# Altium project zx_revo_a3.PrjPcb (part 2 of 3)

## Sheet SDCARD.SchDoc
size A4; SheetNumber: 14; SheetTotal: 15
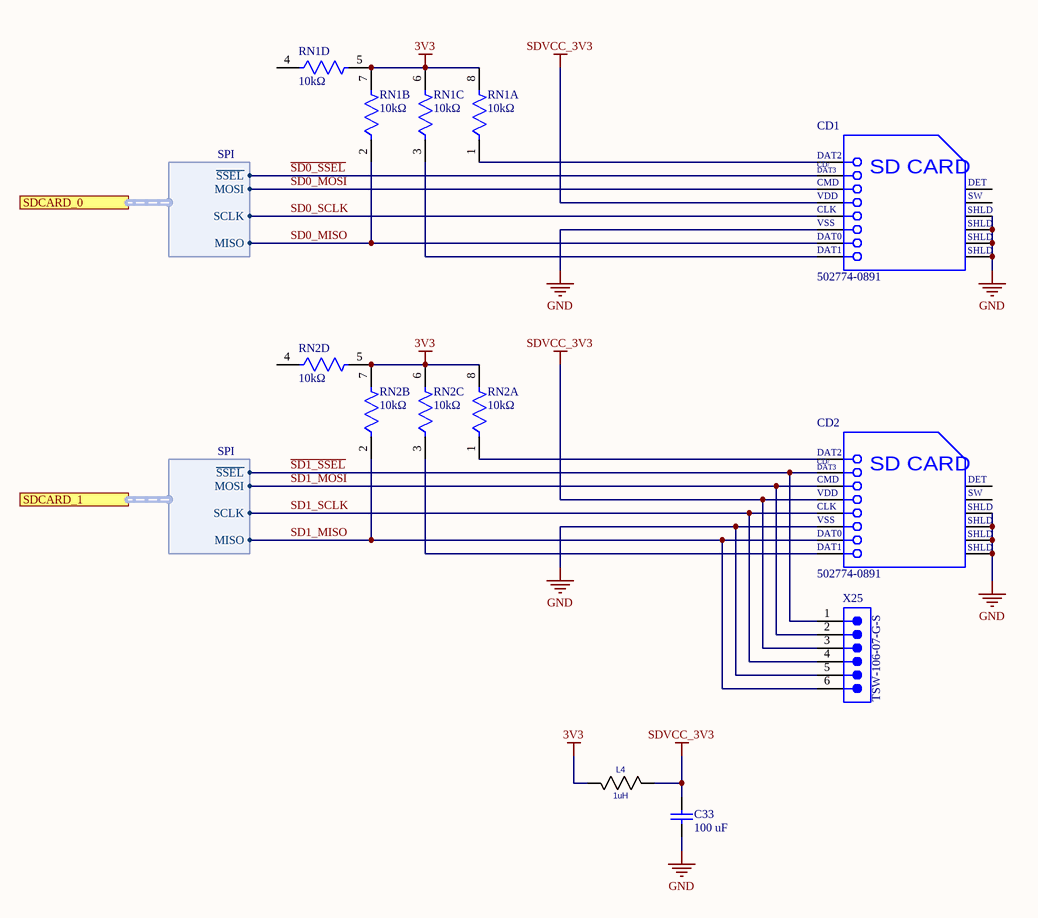
[diagram p7: SDCARD.SchDoc]

### Parts
C33  Capacitance: 100 uF  [CAPC3216X190X55ML30T25]  (hidden comment: GRM31CR60J107ME39L)
CD1  502774-0891  [MOLX-502774-0891_V]
CD2  502774-0891  [MOLX-502774-0891_V]
L4  value 1uH  [L-CHIP]  (hidden comment: L-CHIP)
RN1  Resistance: 10kΩ  [FP-CAT16-F4-MFG]  (hidden comment: CAT16-1002F4LF)  (parts A,B,C,D of 4)
RN2  Resistance: 10kΩ  [FP-CAT16-F4-MFG]  (hidden comment: CAT16-1002F4LF)  (parts A,B,C,D of 4)
X25  TSW-106-07-G-S  [SMTC-TSW-106-07-X-S]

### Ports
SDCARD_0 (harness SPI), SDCARD_1 (harness SPI)

### Harnesses
SPI: ~{SSEL}, SCLK, MOSI, MISO

### Nets
3V3: L4.2 RN1.5 RN1.6 RN1.7 RN1.8 RN2.5 RN2.6 RN2.7 RN2.8
GND: C33.1 CD1.6(VSS) CD1.11(SHLD) CD1.12(SHLD) CD1.13(SHLD) CD1.14(SHLD) CD2.6(VSS) CD2.11(SHLD) CD2.12(SHLD) CD2.13(SHLD) CD2.14(SHLD) X25.5
SDVCC_3V3: C33.2 CD1.4(VDD) CD2.4(VDD) L4.1 X25.3
~{SD0_SSEL}: CD1.2(CD/DAT3) ; port SDCARD_0.~{SSEL}
~{SD1_SSEL}: CD2.2(CD/DAT3) X25.1 ; port SDCARD_1.~{SSEL}
SD0_MISO: CD1.7(DAT0) RN1.2 ; port SDCARD_0.MISO
SD0_MOSI: CD1.3(CMD) ; port SDCARD_0.MOSI
SD0_SCLK: CD1.5(CLK) ; port SDCARD_0.SCLK
SD1_MISO: CD2.7(DAT0) RN2.2 X25.6 ; port SDCARD_1.MISO
SD1_MOSI: CD2.3(CMD) X25.2 ; port SDCARD_1.MOSI
SD1_SCLK: CD2.5(CLK) X25.4 ; port SDCARD_1.SCLK
NetCD1_1: CD1.1(DAT2) RN1.1
NetCD1_8: CD1.8(DAT1) RN1.3
NetCD2_1: CD2.1(DAT2) RN2.1
NetCD2_8: CD2.8(DAT1) RN2.3

Not connected (* = marked no-connect by the designer): CD1 9(DETECT) 10(SWITCH); CD2 9(DETECT) 10(SWITCH); RN1 4; RN2 4

### Notes on the sheet
- (in symbol CMP-2000-05248-1) CD/; DAT3; SD CARD; DET; SW

### Library data of the parts
C33 = CMP-1662-00011-2: Chip Capacitor, 100 uF, +/- 20%, 6.3 V, -55 to 85 degC, 1206 (3216 Metric), RoHS, Tape and Reel; Manufacturer: Murata; value: 100 uF; PackageDescription: 2-Pin Surface Mount Device, Body 3.2 x 1.6 mm; PartNumber: GRM31CR60J107ME39L; Manufacturer Part Number: GRM31CR60J107ME39L; Case/Package: 1206; Category: Cap
CD1 CD2 = CMP-2000-05248-1: Micro SD Memory Card Connector, 0.5 A, 10 V (DC), -25 to 85 degC, 8-Pin SMT, RoHS, Tape and Reel; Manufacturer: Molex; Manufacturer Part Number: 5027740891; value: 5027740891; Category: Connector; Case/Package: Micro SD (molex 5027740891 )
RN1 RN2 = CMP-07230-000003-1: RES ARRAY 4 RES 10K OHM 1206; Manufacturer: Bourns; Voltage Rating: 50V; Power Rating: 0.25W; Tolerance: 1%; Number Of Resistors: 4; Value: 10kΩ; Temperature Coefficient: 200ppm/°C; Description: Res Thick Film Array 10K Ohm 1% ISOL Molded 8-Pin 1206 Concave SMD Paper T/R; Power Per Resistor: 0.0625W; Manufacturer Part Number: CAT16-1002F4LF; Category: Res; Termination: Concave; Series: CAT16; Height: 0.6mm; Device Class L2: Resistors; Digikey Description: RES ARRAY 4 RES 10K OHM 1206; ComponentLink2Description: Datasheet; Temperature Range High: +125°C; ComponentLink2URL: https://www.bourns.com/docs/Product-Datasheets/CATCAY.pdf; Temperature: -55°C to +125°C; Temperature Range Low: -55°C; Octopart: https://octopart.com/cat16-1002f4lf-bourns-1624551; Mouser Description: Resistor Networks & Arrays 10K 1% Concave 4resistors; RoHS: TRUE; Device Class L1: Passive Components; Lead Free: Yes; Automotive: No; Package: CAT16-F4; Device Class L3: Resistor Arrays
X25 = CMP-1024-00383-1: 0.025" SQ Post Header, Through-hole, Vertical, -55 to 125 degC, 2.54 mm Pitch, 6-Pin, Male, RoHS; Manufacturer: Samtec; Pitch: 2.54 mm; value: 6 pin header 2.54mm; PackageDescription: .025[0.64] SQ. Post Terminal Strip Assembly; PartNumber: TSW-106-07-G-S; Manufacturer Part Number: TSW-106-07-G-S; Case/Package: PLS-6; Category: Connector
L4 = L-CHIP: Case/Package: 0805; Category: Inductor

## Sheet Power ATX.SchDoc
size A3; SheetNumber: 2; SheetTotal: 15
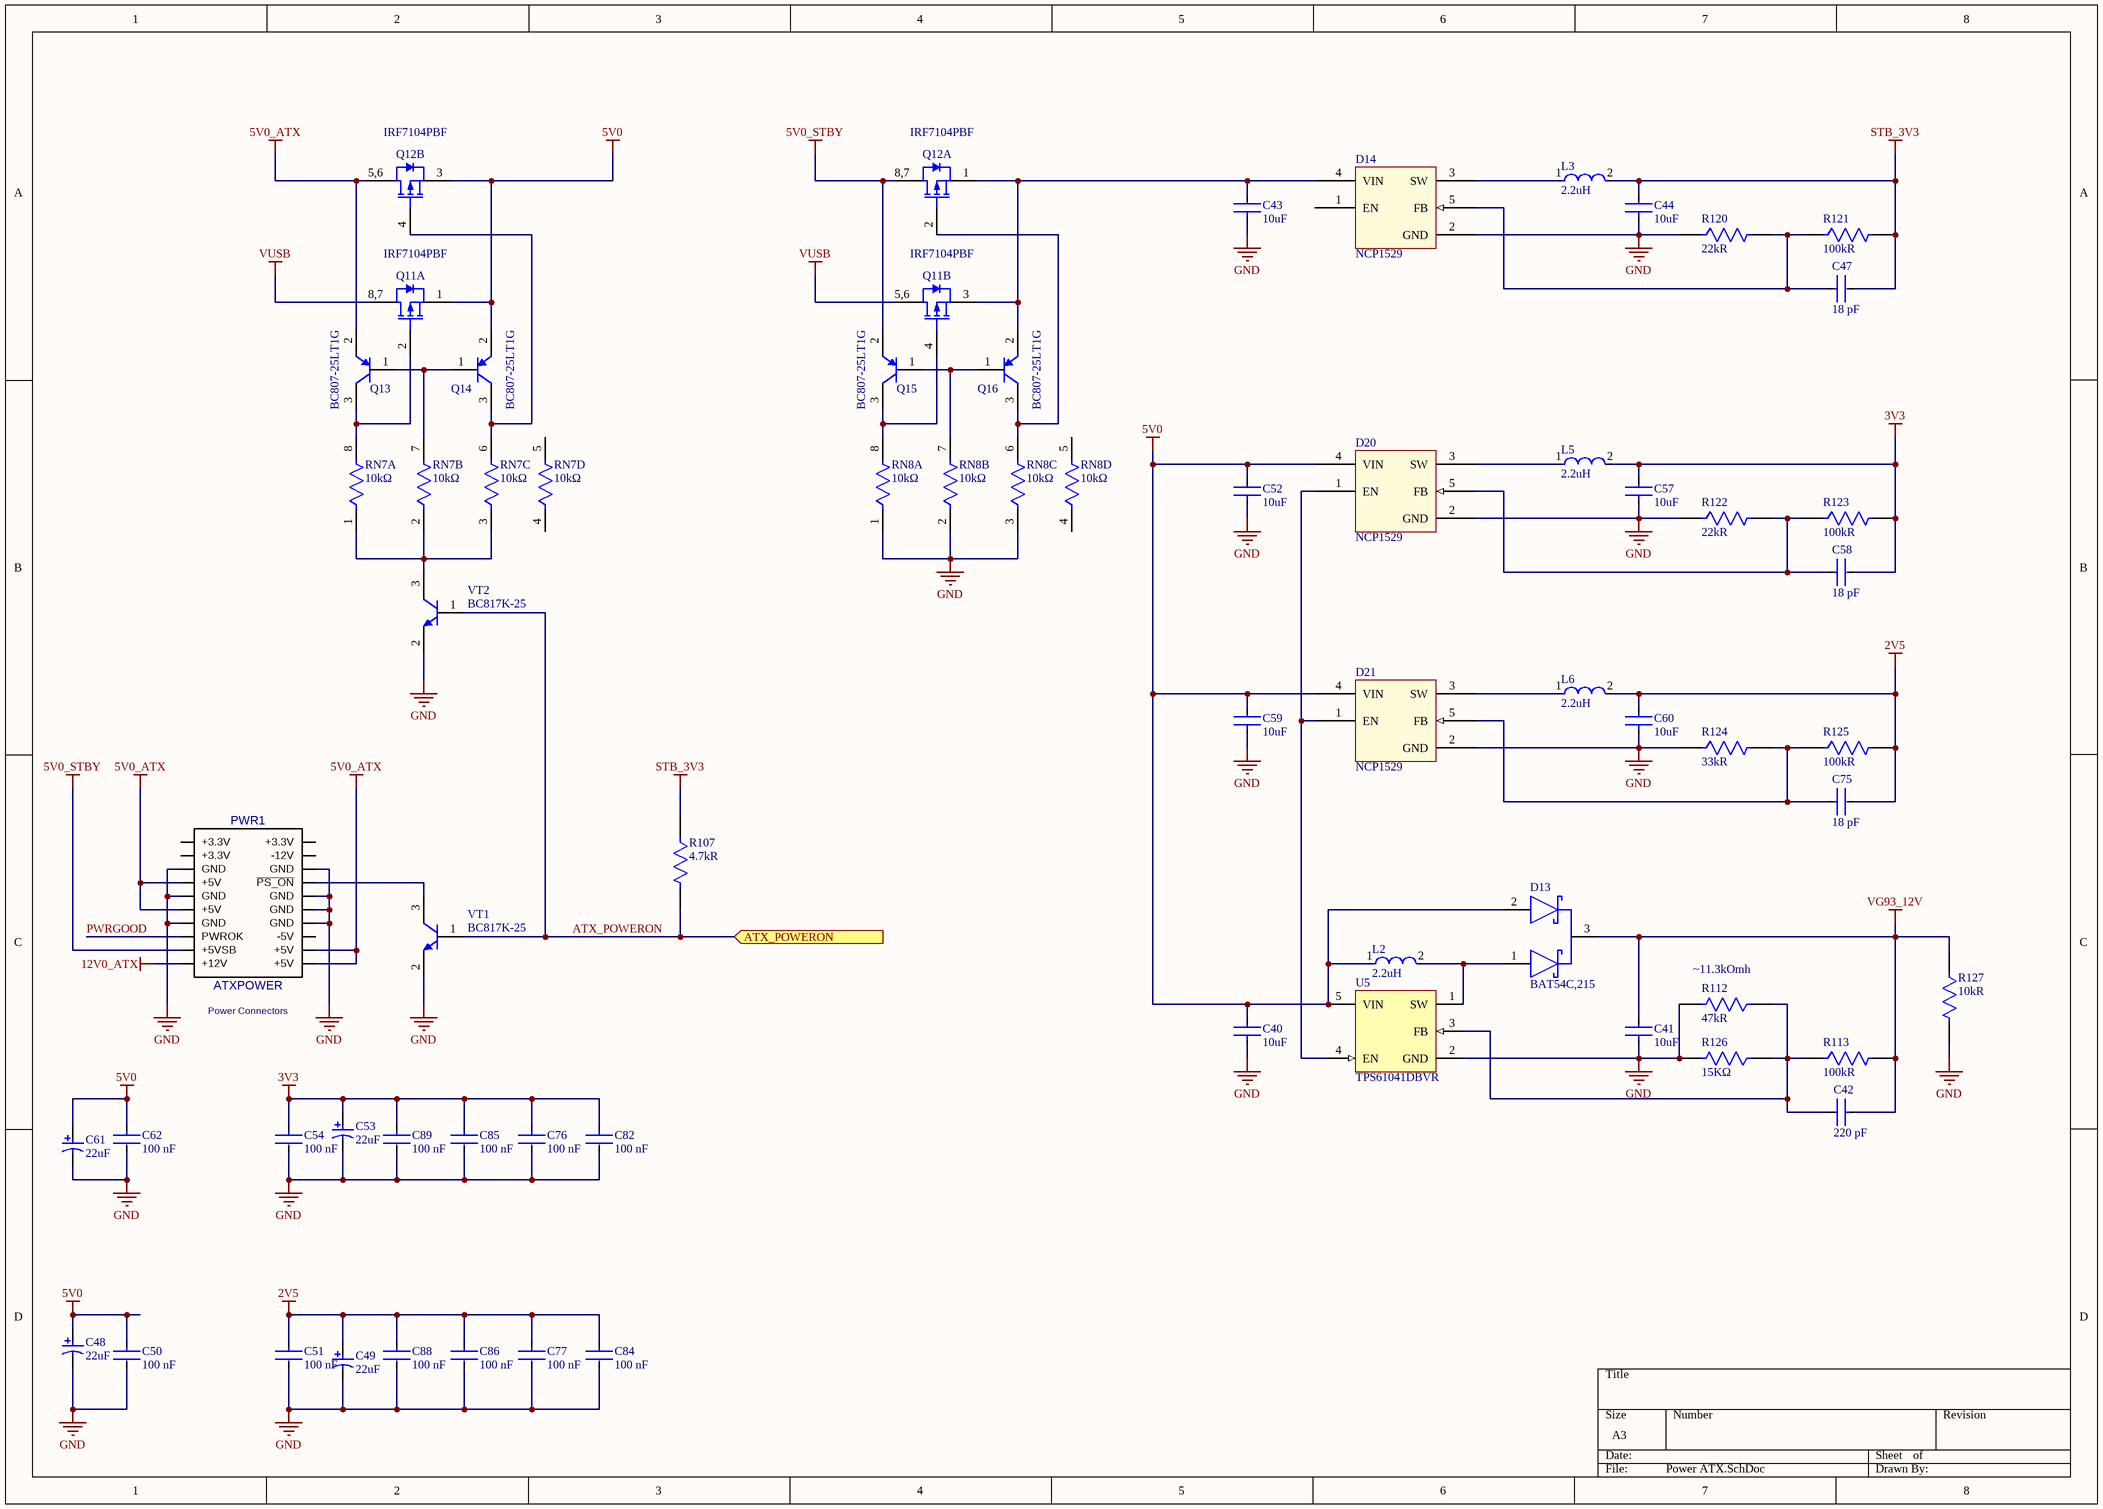
[diagram p8: Power ATX.SchDoc]

### Parts
C40  Capacitance: 10uF  [FP-C0805C-DG-IPC_A]  (hidden comment: C0805C106K8PACTU)
C41  Capacitance: 10uF  [FP-C0805C-DG-IPC_A]  (hidden comment: C0805C106K8PACTU)
C42  Capacitance: 220 pF  [FP-CC0805-0_85-IPC_A]  (hidden comment: CC0805KRX7R9BB221)
C43  Capacitance: 10uF  [FP-C0805C-DG-IPC_A]  (hidden comment: C0805C106K8PACTU)
C44  Capacitance: 10uF  [FP-C0805C-DG-IPC_A]  (hidden comment: C0805C106K8PACTU)
C47  Capacitance: 18 pF  [FP-C0805C-DN-IPC_A]  (hidden comment: C0805C180J5GACTU)
C48  Capacitance: 22uF  [AVX-TAJ-B-2_M]  (hidden comment: TAJB226K016RNJ)
C49  Capacitance: 22uF  [AVX-TAJ-B-2_M]  (hidden comment: TAJB226K016RNJ)
C50  Capacitance: 100 nF  [FP-CC0805-0_85-IPC_A]  (hidden comment: CC0805KRX7R9BB104)
C51  Capacitance: 100 nF  [FP-CC0805-0_85-IPC_A]  (hidden comment: CC0805KRX7R9BB104)
C52  Capacitance: 10uF  [FP-C0805C-DG-IPC_A]  (hidden comment: C0805C106K8PACTU)
C53  Capacitance: 22uF  [AVX-TAJ-B-2_M]  (hidden comment: TAJB226K016RNJ)
C54  Capacitance: 100 nF  [FP-CC0805-0_85-IPC_A]  (hidden comment: CC0805KRX7R9BB104)
C57  Capacitance: 10uF  [FP-C0805C-DG-IPC_A]  (hidden comment: C0805C106K8PACTU)
C58  Capacitance: 18 pF  [FP-C0805C-DN-IPC_A]  (hidden comment: C0805C180J5GACTU)
C59  Capacitance: 10uF  [FP-C0805C-DG-IPC_A]  (hidden comment: C0805C106K8PACTU)
C60  Capacitance: 10uF  [FP-C0805C-DG-IPC_A]  (hidden comment: C0805C106K8PACTU)
C61  Capacitance: 22uF  [AVX-TAJ-B-2_M]  (hidden comment: TAJB226K016RNJ)
C62  Capacitance: 100 nF  [FP-CC0805-0_85-IPC_A]  (hidden comment: CC0805KRX7R9BB104)
C75  Capacitance: 18 pF  [FP-C0805C-DN-IPC_A]  (hidden comment: C0805C180J5GACTU)
C76  Capacitance: 100 nF  [FP-CC0805-0_85-IPC_A]  (hidden comment: CC0805KRX7R9BB104)
C77  Capacitance: 100 nF  [FP-CC0805-0_85-IPC_A]  (hidden comment: CC0805KRX7R9BB104)
C82  Capacitance: 100 nF  [FP-CC0805-0_85-IPC_A]  (hidden comment: CC0805KRX7R9BB104)
C84  Capacitance: 100 nF  [FP-CC0805-0_85-IPC_A]  (hidden comment: CC0805KRX7R9BB104)
C85  Capacitance: 100 nF  [FP-CC0805-0_85-IPC_A]  (hidden comment: CC0805KRX7R9BB104)
C86  Capacitance: 100 nF  [FP-CC0805-0_85-IPC_A]  (hidden comment: CC0805KRX7R9BB104)
C88  Capacitance: 100 nF  [FP-CC0805-0_85-IPC_A]  (hidden comment: CC0805KRX7R9BB104)
C89  Capacitance: 100 nF  [FP-CC0805-0_85-IPC_A]  (hidden comment: CC0805KRX7R9BB104)
D13  BAT54C,215  [FP-SOT23-MFG]
D14  NCP1529  [TSOP-95-5N]
D20  NCP1529  [TSOP-95-5N]
D21  NCP1529  [TSOP-95-5N]
L2  Inductance: 2.2uH  [FP-DFE252012C-MFG]  (hidden comment: DFE252012P-2R2M=P2)
L3  Inductance: 2.2uH  [FP-DFE252012C-MFG]  (hidden comment: DFE252012P-2R2M=P2)
L5  Inductance: 2.2uH  [FP-DFE252012C-MFG]  (hidden comment: DFE252012P-2R2M=P2)
L6  Inductance: 2.2uH  [FP-DFE252012C-MFG]  (hidden comment: DFE252012P-2R2M=P2)
PWR1  ATXPOWER  [ATXPOWER]
Q11  IRF7104PBF  [SOIC127P600X155-8N]  (parts A,B of 2)
Q12  IRF7104PBF  [SOIC127P600X155-8N]  (parts A,B of 2)
Q13  BC807-25LT1G  [ONSC-SOT-23-3-318-08_V]
Q14  BC807-25LT1G  [ONSC-SOT-23-3-318-08_V]
Q15  BC807-25LT1G  [ONSC-SOT-23-3-318-08_V]
Q16  BC807-25LT1G  [ONSC-SOT-23-3-318-08_V]
R107  Resistance: 4.7kR  [FP-CR0805-IPC_A]  (hidden comment: CR0805-JW-472ELF)
R112  Resistance: 47kR  [FP-CRCW0805-HPe3-IPC_A]  (hidden comment: CRCW080547K0FKEAHP)
R113  Resistance: 100kR  [FP-ERA6A-IPC_A]  (hidden comment: ERA-6AEB104V)
R120  Resistance: 22kR  [FP-CRCW0805-e3-IPC_A]  (hidden comment: CRCW080522K0JNEA)
R121  Resistance: 100kR  [FP-ERA6A-IPC_A]  (hidden comment: ERA-6AEB104V)
R122  Resistance: 22kR  [FP-CRCW0805-e3-IPC_A]  (hidden comment: CRCW080522K0JNEA)
R123  Resistance: 100kR  [FP-ERA6A-IPC_A]  (hidden comment: ERA-6AEB104V)
R124  Resistance: 33kR  [FP-RMCF0805-IPC_A]  (hidden comment: RMCF0805JT33K0)
R125  Resistance: 100kR  [FP-ERA6A-IPC_A]  (hidden comment: ERA-6AEB104V)
R126  Resistance: 15KΩ  [FP-RN732A-IPC_A]  (hidden comment: RN73C2A15KBTDF)
R127  Resistance: 10kR  [FP-CR0805-IPC_A]  (hidden comment: CR0805-JW-103ELF)
RN7  Resistance: 10kΩ  [FP-CAT16-F4-MFG]  (hidden comment: CAT16-1002F4LF)  (parts A,B,C,D of 4)
RN8  Resistance: 10kΩ  [FP-CAT16-F4-MFG]  (hidden comment: CAT16-1002F4LF)  (parts A,B,C,D of 4)
U5  TPS61041DBVR  [DBV0005A_M]
VT1  BC817K-25  [INF-SOT23_N]
VT2  BC817K-25  [INF-SOT23_N]

### Ports
ATX_POWERON (in)

### Nets
2V5: C49.1 C51.1 C60.2 C75.2 C77.1 C84.1 C86.1 C88.1 L6.2 R125.2
3V3: C53.1 C54.1 C57.2 C58.2 C76.1 C82.1 C85.1 C89.1 L5.2 R123.2
5V0: C40.2 C48.1 C50.1 C52.2 C59.2 C61.1 C62.1 D13.2(2_ANODE) D20.4(VIN) D21.4(VIN) L2.1 Q11.1(SOURCE) Q12.3(SOURCE) Q14.2(E) U5.5(VIN)
5V0_ATX: PWR1.4(+5V) PWR1.6(+5V) PWR1.19(+5V) PWR1.20(+5V) Q12.5,6(DRAIN) Q13.2(E)
5V0_STBY: PWR1.9(+5VSB) Q12.8,7(DRAIN) Q15.2(E)
12V0_ATX: PWR1.10(+12V)
GND: C40.1 C41.1 C43.1 C44.1 C48.2 C49.2 C50.2 C51.2 C52.1 C53.2 C54.2 C57.1 C59.1 C60.1 C61.2 C62.2 C76.2 C77.2 C82.2 C84.2 C85.2 C86.2 C88.2 C89.2 D14.2(GND) D20.2(GND) D21.2(GND) PWR1.3(GND) PWR1.5(GND) PWR1.7(GND) PWR1.13(GND) PWR1.15(GND) PWR1.16(GND) PWR1.17(GND) R112.2 R120.1 R122.1 R124.1 R126.2 R127.2 RN8.1 RN8.2 RN8.3 U5.2(GND) VT1.2(E) VT2.2(E)
STB_3V3: C44.2 C47.2 L3.2 R107.1 R121.2
VG93_12V: C41.2 C42.1 D13.3(COMMON_CATHODE) R113.2 R127.1
VUSB: Q11.5,6(DRAIN) Q11.8,7(DRAIN)
ATX_POWERON: R107.2 VT1.1(B) VT2.1(B) ; port ATX_POWERON
PWRGOOD: PWR1.8(PWROK)  [project net PWRGOOD_2]
NetC42_2: C42.2 R112.1 R113.1 R126.1 U5.3(FB)
NetC43_2: C43.2 D14.4(VIN) Q11.3(SOURCE) Q12.1(SOURCE) Q16.2(E)
NetC47_1: C47.1 D14.5(FB) R120.2 R121.1
NetC58_1: C58.1 D20.5(FB) R122.2 R123.1
NetC75_1: C75.1 D21.5(FB) R124.2 R125.1
NetD13_1: D13.1(1_ANODE) L2.2 U5.1(SW)
NetD14_3: D14.3(SW) L3.1
NetD20_1: D20.1(EN) D21.1(EN) U5.4(EN)
NetD20_3: D20.3(SW) L5.1
NetD21_3: D21.3(SW) L6.1
NetPWR1_14: PWR1.14(~{PS_ON}) VT1.3(C)
NetQ11_2: Q11.2(GATE) Q13.3(C) RN7.8
NetQ11_4: Q11.4(GATE) Q15.3(C) RN8.8
NetQ12_2: Q12.2(GATE) Q16.3(C) RN8.6
NetQ12_4: Q12.4(GATE) Q14.3(C) RN7.6
NetQ13_1: Q13.1(B) Q14.1(B) RN7.7
NetQ15_1: Q15.1(B) Q16.1(B) RN8.7
NetRN7_1: RN7.1 RN7.2 RN7.3 VT2.3(C)

Not connected (* = marked no-connect by the designer): D14 1(EN); PWR1 1(+3.3V) 2(+3.3V) 11(+3.3V) 12(-12V) 18(-5V); RN7 4 5; RN8 4 5

### Notes on the sheet
- (near R112) ~11.3kOmh
- (near PWR1) Power Connectors

### Library data of the parts
C40 C41 C43 C44 C52 C57 C59 C60 = CMP-2007-03243-2: CAP CER 10UF 10V X5R 0805; Manufacturer: KEMET; Manufacturer Part Number: C0805C106K8PACTU; Value: 10uF; Category: Cap; Case/Package: 0805
C42 = CMP-1036-02315-3: CAP CER 220PF 50V X7R 0805; Manufacturer Part Number: VJ0805A221KXAPW1BC; Manufacturer: Vishay Vitramon; Value: 220 pF; Category: Cap; Case/Package: 0805
C47 C58 C75 = CMP-2007-00302-2: CAP CER 18PF 50V C0G/NP0 0805; Manufacturer: KEMET; Temperature Characteristic: C0G; Tolerance: 0.05; Material: Ceramic; Temperature Coefficient: 30ppm/°C; Device Class L2: Capacitors; Temperature: -55°C to +125°C; Value: 18 pF; Package: C0805C-DN; Mouser Description: Cap Ceramic 18pF 50V C0G 5% SMD 0805 125C Paper T/R; Height: 0.88mm; ComponentLink2URL: https://content.kemet.com/datasheets/KEM_C1003_C0G_SMD.pdf; RoHS: TRUE; Octopart: https://octopart.com/c0805c180j5gactu-kemet-144810; ComponentLink2Description: Datasheet; Temperature Range High: +125°C; Digikey Description: CAP CER 18PF 50V C0G/NP0 0805; Device Class L1: Passive Components; Category: Cap; Automotive: No; Device Class L3: Ceramic Capacitors; Voltage Rating: 50 V; Temperature Range Low: -55°C; Ipc Land Pattern Name: CAPC200125X78; Lead Free: Yes; Manufacturer Part Number: C0805C180J5GACTU
C48 C49 C53 C61 = CMP-2100-03689-1: Standard Tantalum, 22 uF, +/- 10%, 16 V, -55 to 125 degC, 2-Pin SMD (1210), RoHS, Tape and Reel; Manufacturer: Kyocera AVX; value: 22uF; Number of Pins: 2; Termination: SMD/SMT; Case/Package: 1210; Manufacturer Part Number: TAJB226K016RNJ; Category: Cap
C50 C51 C54 C62 C76 C77 C82 C84-C86 C88 C89 = CMP-2100-03606-3: CAP CER 0.1UF 50V X7R 0805; Manufacturer: Yageo; Value: 100 nF; Manufacturer Part Number: CC0805KRX7R9BB104; Category: Cap; Case/Package: 0805
D13 = CMP-14398-000007-1: DIODE ARRAY SCHOTTKY 30V SOT23; Manufacturer: Nexperia; Automotive Grade: Grade 0; Peak Reverse Current: 2uA; Forward Current: 200mA; Max Surge Forward Current: 600mA; Value: 10pF; Max Junction Temp: +150°C; Lead Free: Yes; Automotive: Yes; Device Class L1: Discrete Semiconductors; Digikey Description: DIODE ARRAY SCHOTTKY 30V SOT23; Reverse Voltage: 30V; ComponentLink2URL: https://assets.nexperia.com/documents/data-sheet/BAT54_SER.pdf; Device Class L2: Diodes; Category: Diode; Octopart: https://octopart.com/bat54c%2C215-nexperia-78738945; Package: SOT23; Mouser Description: Schottky Diodes, Rectifiers - Arrays SOT-23 (TO-236AB) 30V 200mA (DC) Surface Mount; RoHS: TRUE; Manufacturer Part Number: BAT54C,215; Temperature: to +150°C; Ambient Temperature Range Low: -55°C; Height: 1.1mm; Device Class L3: Schottky Diodes; Temperature Range High: +150°C; Footprint Url: https://assets.nexperia.com/documents/outline-drawing/SOT23.pdf; Capacitance: 10pF; Ambient Temperature Range High: +150°C; Ipc Land Pattern Name: SOT95P230X100-3; ComponentLink2Description: Datasheet
D14 D20 D21 = NCP1529ASNT1G: Buck Converter - DC-DC, / High Efficiency, Adjustable / Output Voltage, Low Ripple / 1.7 MHz, 1 A; Case/Package: TSOP-8; Mount: Surface Mount; Number of Pins: 5
L2 L3 L5 L6 = CMP-06042-014522-1: Shielded Wirewound Inductor 2.2uH 20% 2200mA 0.084Ω 1008 (2520); Max DC Current: 2.2A; Current Rating: 3A; Core Material: Ferrite; Test Frequency: 1MHz; DC Resistance (DCR): 84mR; Case/Package: 1008; Case Code (Metric): 2520; Resistor Type: Wirewound; Lead Free: Lead Free; Shielding: Shielded; Depth: 2mm; Case Code (Imperial): 1008; Packaging: Tape and Reel; Width: 0.079inch; Min Operating Temperature: -40°C; Height - Seated (Max): 0.039inch; Tolerance: 20%; Max Operating Temperature: 125°C; Mount: Surface Mount; Length: 0.098inch
PWR1 = ATXPOWER: Analogs: MF-20MA;N42GP-20; Value: ATXPOWER; Case/Package: Mini-Fit 20 PIN 5.2; Category: Connector
Q11 Q12 = IRF7104PBF: IRF7104PBF Dual P-channel MOSFET Transistor; 2.3 A; 20 V; 8-Pin SOIC; Continuous Drain Current (ID): 2.3 A; Drain to Source Breakdown Voltage: -20 V; Drain to Source Resistance: 250 mΩ; Gate to Source Voltage (Vgs): 12 V; Nominal Vgs: -3 V; Number of Elements: 2; Case/Package: SOIC; Mount: Surface Mount; Number of Pins: 8
Q13-Q16 = CMP-1048-00691-1: General Purpose Transistor, PNP Silicon, 3-Pin SOT-23, Pb-Free, Tape and Reel; Manufacturer: On Semiconductor; IC Continuous (A): -0.5; fT Min (MHz): 100; PackageDescription: 3-Pin Small Outline Transistor, Body 2.92 x 1.3 mm, Pitch 0.95 mm; Polarity: PNP; ComponentLink2URL: http://www.onsemi.com/pub_link/Collateral/BC807-16LT1-D.PDF; PackageReference: SOT-23-3-318-08; ComponentLink2Description: Datasheet; ComponentLink1Description: Manufacturer URL; PartNumber: BC807-25LT1G; ComponentLink3URL: http://www.onsemi.cn/pub_link/Collateral/318-08.PDF; Packing: Tape and Reel; DatasheetVersion: Rev. 10; RoHS: TRUE; ComponentLink3Description: Package Specification; PackageVersion: Rev. AP, 11/2009; ComponentLink1URL: http://www.onsemi.com/; Mounting Technology: Surface Mount
R107 = CMP-07231-004713-1: Thick Film Chip Resistors 0805 4.7kΩ 0.125W 5% 200ppm/°C; Manufacturer: Bourns; Case/Package: 0805; Number of Terminations: 2; Termination: SMD/SMT; Manufacturer Part Number: CR0805-JW-472ELF; value: 4.7kΩ; Category: Res
R112 = CMP-02407-008731-1: RES Thick Film, 47kΩ, 1%, 0.5W, 100ppm/°C, 0805; Manufacturer: Vishay; Number of Terminations: 2; Termination: SMD/SMT; Case/Package: 0805; Manufacturer Part Number: CRCW080547K0FKEAHP; value: 47kΩ; Category: Res
R113 R121 R123 R125 = CMP-2001-00583-2: RES 100K OHM 0.1% 1/8W 0805; Max Power Dissipation: 125mW; Voltage Rating: 100V; Temperature Coefficient: 25ppm/°C; Resistance Tolerance: 0.1%; Resistor Type: Thin Film; Mount: Surface Mount; Package Quantity: 1; RoHS Compliant: Yes; Features: Automotive AEC-Q200; Termination: Solder; Contact Plating: Tin; Number of Pins: 2; Construction: Rectangular; Size Code: 0805; Case/Package: 0805; Military Standard: Not; Voltage Rating (DC): 100V; Max Operating Temperature: 155°C; REACH SVHC: No SVHC; Series: ERA-6A; Case Code (Metric): 2012; Number of Terminations: 2; Tolerance: 0.1%; Width: 1.25mm; Depth: 1.25mm; Lead Free: Lead Free; Radiation Hardening: No; Length: 2mm; Technology: METAL FILM; Power Rating: 125mW; Min Operating Temperature: -55°C; Height: 0.5mm; Case Code (Imperial): 0805; Packaging: Tape and Reel
R120 R122 = CMP-02407-007310-1: RES Thick Film, 22kΩ, 5%, 0.125W, 200ppm/°C, 0805; Voltage Rating: 150V; Power Rating: 125mW; Width: 0.049inch; Packaging: Tape and Reel; Case Code (Imperial): 0805; Max Operating Temperature: 155°C; Tolerance: 5%; Number of Terminations: 2; Termination: SMD/SMT; Length: 2mm; Weight: 0.000194oz; Military Standard: Not; Contact Plating: Tin; Radiation Hardening: No; Depth: 1.25mm; Min Operating Temperature: -55°C; Max Power Dissipation: 125mW; Height: 0.02inch; Case Code (Metric): 2012; Temperature Coefficient: 200ppm/°C; Composition: Thick Film; Features: Automotive AEC-Q200; Package Quantity: 1; Voltage Rating (DC): 150V; Case/Package: 0805; Lead Free: Lead Free
R124 = CMP-26527-001097-1: 33kΩ ±5% 0.125W 0805 Thick Film Chip Resistor AEC-Q200 compliant; Manufacturer: Stackpole Electronics; Number of Terminations: 2; Case/Package: 0805; Manufacturer Part Number: RMCF0805JT33K0; value: 33kΩ; Category: Res
R126 = CMP-03211-008328-1: SMD Chip Resistor, Thin Film, 15KΩ, 100 V, 0805 [2012 Metric], 100 mW, 0.1%, RN73 Series; Manufacturer: TE Connectivity; Manufacturer Part Number: RN73C2A15KBTDF; Category: Res; Value: 15KΩ; Case/Package: 0805
R127 = CMP-07231-003873-1: Thick Film Chip Resistors 0805 10kΩ 0.125W 5% 200ppm/°C; Manufacturer: Bourns; value: 10kΩ; Manufacturer Part Number: CR0805-JW-103ELF; Number of Terminations: 2; Termination: SMD/SMT; Number of Pins: 2; Case/Package: 0805; Category: Res
RN7 RN8 = CMP-07230-000003-1: RES ARRAY 4 RES 10K OHM 1206; Manufacturer: Bourns; Voltage Rating: 50V; Power Rating: 0.25W; Tolerance: 1%; Number Of Resistors: 4; Value: 10kΩ; Temperature Coefficient: 200ppm/°C; Power Per Resistor: 0.0625W; Manufacturer Part Number: CAT16-1002F4LF; Category: Res; Termination: Concave; Series: CAT16; Height: 0.6mm; Device Class L2: Resistors; Digikey Description: RES ARRAY 4 RES 10K OHM 1206; ComponentLink2Description: Datasheet; Temperature Range High: +125°C; ComponentLink2URL: https://www.bourns.com/docs/Product-Datasheets/CATCAY.pdf; Temperature: -55°C to +125°C; Temperature Range Low: -55°C; Octopart: https://octopart.com/cat16-1002f4lf-bourns-1624551; Mouser Description: Resistor Networks & Arrays 10K 1% Concave 4resistors; RoHS: TRUE; Device Class L1: Passive Components; Lead Free: Yes; Automotive: No; Package: CAT16-F4; Device Class L3: Resistor Arrays
U5 = CMP-0388-00116-2: 28 V, 250 mA Switch Boost Converter for LCD and White LED Applications, 1.8 to 6 V, -40 to 85 degC, 5-pin SOT23 (DBV5), Green (RoHS & no Sb/Br); Manufacturer: Texas Instruments; SubFamily: White LED Driver; Vin(Max)(V): 6; Rating: Catalog; Switching Frequency(Max)(kHz): 1000; Dimming: TRUE; Iq(Typ)(mA): 0.028; Vin(Min)(V): 1.8; Iout(Max)(A): 0.05; PackageVersion: 4073253-4/K; PackageDescription: 5-Pin Plastic Small Outline, Body 1.60 Ãƒâ€” 2.90 mm, Pitch 0.95 mm; Mounting Technology: Surface Mount; Topology: Boost; ComponentLink2Description: Datasheet; DatasheetVersion: SLVS413F; ComponentLink3URL: http://www.ti.com/litv/pdf/mpds018i; ComponentLink3Description: Package Specification; Code_JEDEC: MO-178; Eco-Plan: Green (RoHS & no Sb/Br); ComponentLink1URL: http://www.ti.com/; ComponentLink2URL: http://www.ti.com/general/docs/lit/getliterature.tsp?genericPartNumber=TPS61041&fileType=pdf; PackageReference: DBV0005A; PartNumber: TPS61041DBVR; ComponentLink1Description: Manufacturer URL
VT1 VT2 = CMP-1177-00027-1: NPN Silicon AF Transistor, 45 V VCEO, 500 mA IC, SOT23, Reel, Green; Manufacturer: Infineon; PackageDescription: 3-Pin Small Outline Transistor Package, 1.3 x 2.9 mm Body, 0.95 mm Pitch; PartNumber: BC817K-25; Manufacturer Part Number: BC817K-25; value: BC817K-25; Case/Package: SOT-23; Category: Transistor

## Sheet USB.SchDoc
size A4; SheetNumber: 7; SheetTotal: 15
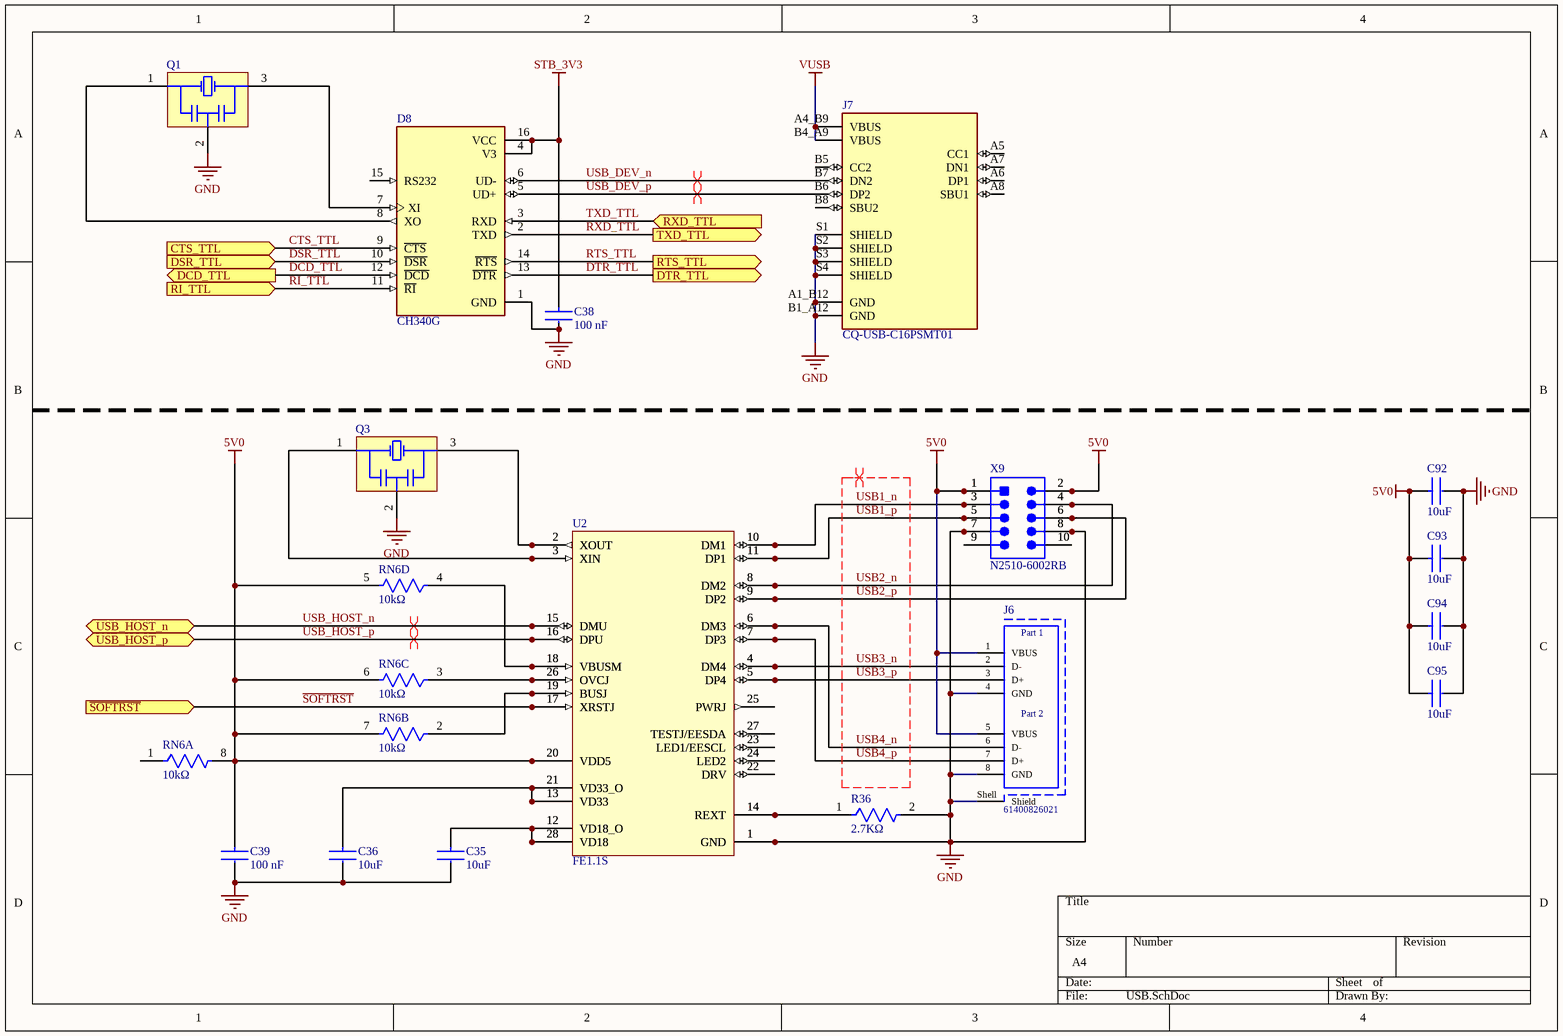
[diagram p9: USB.SchDoc]

### Parts
C35  Capacitance: 10uF  [FP-C0805C-DG-IPC_A]  (hidden comment: C0805C106K8PACTU)
C36  Capacitance: 10uF  [FP-C0805C-DG-IPC_A]  (hidden comment: C0805C106K8PACTU)
C38  Capacitance: 100 nF  [FP-CC0805-0_85-IPC_A]  (hidden comment: CC0805KRX7R9BB104)
C39  Capacitance: 100 nF  [FP-CC0805-0_85-IPC_A]  (hidden comment: CC0805KRX7R9BB104)
C92  Capacitance: 10uF  [FP-C0805C-DG-IPC_A]  (hidden comment: C0805C106K8PACTU)
C93  Capacitance: 10uF  [FP-C0805C-DG-IPC_A]  (hidden comment: C0805C106K8PACTU)
C94  Capacitance: 10uF  [FP-C0805C-DG-IPC_A]  (hidden comment: C0805C106K8PACTU)
C95  Capacitance: 10uF  [FP-C0805C-DG-IPC_A]  (hidden comment: C0805C106K8PACTU)
D8  CH340G  [SOIC127P600X180-16N]
J6  61400826021  [61400826021]
J7  CQ-USB-C16PSMT01  [SHENZHEN-CHUANGQIN-TECHNOLOGY_CQ-USB-C16PSMT01]
Q1  CSTCE12M0G55Z-R0  [MURA-CSTCE_G_V]  (value not drawn)
Q3  CSTCE12M0G55Z-R0  [MURA-CSTCE_G_V]  (value not drawn)
R36  Resistance: 2.7KΩ  [FP-AC0805-IPC_A]  (hidden comment: AC0805FR-072K7L)
RN6  Resistance: 10kΩ  [FP-CAT16-F4-MFG]  (hidden comment: CAT16-1002F4LF)  (parts A,B,C,D of 4)
U2  FE1.1S  [TSOP64P600X160-28L]
X9  N2510-6002RB  [3M-N2510-6002-10_V]

### Ports
CTS_TTL (in), DCD_TTL (out), DSR_TTL (in), DTR_TTL (out), RI_TTL (in), RTS_TTL (out), RXD_TTL (in), TXD_TTL (out), USB_HOST_n (bidir), USB_HOST_p (bidir), ~{SOFTRST} (in)

### Nets
5V0: C39.1 C92.1 C93.1 C94.1 C95.1 J6.1(VBUS) J6.5(VBUS) RN6.5 RN6.6 RN6.7 RN6.8 U2.20(VDD5) X9.1 X9.2
GND: C35.2 C36.2 C38.2 C39.2 C92.2 C93.2 C94.2 C95.2 D8.1(GND) J6.4(GND) J6.8(GND) J6.Shell(Shield) J7.A1_B12(GND) J7.B1_A12(GND) J7.S1(SHIELD) J7.S2(SHIELD) J7.S3(SHIELD) J7.S4(SHIELD) Q1.2(GND) Q3.2(GND) R36.2 U2.1(GND) X9.7 X9.8
STB_3V3: C38.1 D8.4(V3) D8.16(VCC)
VUSB: J7.A4_B9(VBUS) J7.B4_A9(VBUS)
CTS_TTL: D8.9(~{CTS}) ; port CTS_TTL
DCD_TTL: D8.12(~{DCD}) ; port DCD_TTL
DSR_TTL: D8.10(~{DSR}) ; port DSR_TTL
DTR_TTL: D8.13(~{DTR}) ; port DTR_TTL
RI_TTL: D8.11(~{RI}) ; port RI_TTL
RTS_TTL: D8.14(~{RTS}) ; port RTS_TTL
RXD_TTL: D8.2(TXD) ; port TXD_TTL
~{SOFTRST}: U2.17(XRSTJ) ; port ~{SOFTRST}
TXD_TTL: D8.3(RXD) ; port RXD_TTL
USB1_n: U2.10(DM1) X9.3  [project net USB1_n_7]
USB1_p: U2.11(DP1) X9.5  [project net USB1_p_7]
USB2_n: U2.8(DM2) X9.4  [project net USB2_n_7]
USB2_p: U2.9(DP2) X9.6  [project net USB2_p_7]
USB3_n: J6.2(D-) U2.4(DM4)  [project net USB3_n_7]
USB3_p: J6.3(D+) U2.5(DP4)  [project net USB3_p_7]
USB4_n: J6.6(D-) U2.6(DM3)  [project net USB4_n_7]
USB4_p: J6.7(D+) U2.7(DP3)  [project net USB4_p_7]
USB_DEV_n: D8.6(UD-) J7.B7(DN2)  [project net USB_DEV_n_7]
USB_DEV_p: D8.5(UD+) J7.B6(DP2)  [project net USB_DEV_p_7]
USB_HOST_n: U2.15(DMU) ; port USB_HOST_n  [project net USB_n]
USB_HOST_p: U2.16(DPU) ; port USB_HOST_p  [project net USB_p]
NetC35_1: C35.1 U2.12(VD18_O) U2.28(VD18)
NetC36_1: C36.1 U2.13(VD33) U2.21(VD33_O)
NetD8_7: D8.7(XI) Q1.3(X2)
NetD8_8: D8.8(XO) Q1.1(X1)
NetQ3_1: Q3.1(X1) U2.3(XIN)
NetQ3_3: Q3.3(X2) U2.2(XOUT)
NetR36_1: R36.1 U2.14(REXT)
NetRN6_2: RN6.2 U2.19(BUSJ)
NetRN6_3: RN6.3 U2.26(OVCJ)
NetRN6_4: RN6.4 U2.18(VBUSM)

Not connected (* = marked no-connect by the designer): D8 15(RS232); J7 A5(CC1) A6(DP1) A7(DN1) A8(SBU1) B5(CC2) B8(SBU2); RN6 1; U2 22(DRV) 23(LED1/EESCL) 24(LED2) 25(PWRJ) 27(TESTJ/EESDA); X9 9 10

### Layout directives
differential pair: USB1_n, USB1_p, USB2_n, USB2_p, USB3_n, USB3_p, USB4_n, USB4_p, USB_DEV_n_7, USB_DEV_p_7, USB_n, USB_p

### Notes on the sheet
- (in symbol 61400826021) Part 1; Part 2

### Library data of the parts
C35 C36 C92-C95 = CMP-2007-03243-2: as C40 on sheet Power ATX; Manufacturer Part Number: C0805C106K8PACTU; Value: 10uF; Category: Cap; Case/Package: 0805
C38 C39 = CMP-2100-03606-3: as C50 on sheet Power ATX; Category: Cap; Manufacturer Part Number: CC0805KRX7R9BB104; Case/Package: 0805
D8 = CH340G: USB Interface Integrated Circuit; Value: CH340G; Case/Package: SOIC-16; Category: IC
J6 = 61400826021: USB 2.0 Type A Receptacle WR-COM, Stacked Horizontal, THT; Manufacturer: Wurth Elektronik; Contact Resistance: 20mOhm; Rated Current: 1.5A; Working Voltage: 30VAC; Connector Type: USB2.0TypeA; Packaging: Tray; Package Reference: 61400826021; Mounting Technology: THT; Datasheet URL: https://katalog.we-online.de/em/datasheet/61400826021.pdf; Operating Temperature: -40to105degC; Gender: Receptacle; Orientation: StackedHorizontal; Part Number: 61400826021; Publisher: WurthElektronik; Manufacturer URL: http://www.we-online.de
J7 = CQ-USB-C16PSMT01: C Type USB Type-C Female Plug 16 Pin Connector Power Charger Jack Port; MF: Shenzen Chuangqin Technology; MP: CQ-USB-C16PSMT01; Price: None; Package: Package; Availability: Unavailable; SnapEDA_Link: https://www.snapeda.com/parts/CQ-USB-C16PSMT01/Shenzen%20Chuangqin%20Technology/view-part/5798994/?ref=snap; Check_prices: https://www.snapeda.com/parts/CQ-USB-C16PSMT01/Shenzen%20Chuangqin%20Technology/view-part/5798994/?ref=eda; Value: *
Q1 Q3 = CMP-2000-06123-1: Ceramic Resonator, 12 MHz, +/- 0.5%, -40 to 125 degC, 3-Pin SMD, RoHS, Tape and Reel; Manufacturer: Murata; Capacitance: 33pF; Category: CrystalsandOscillators; Manufacturer Part Number: CSTCE12M0G55Z-R0; value: CSTCE12M0G55Z-R0
R36 = CMP-2001-04496-2: RES SMD 2.7K OHM 1% 1/8W 0805; Manufacturer: Yageo; Value: 2.7KΩ; Manufacturer Part Number: AC0805FR-072K7L; Category: Res; Case/Package: 0805
RN6 = CMP-07230-000003-1: as RN7 on sheet Power ATX; Manufacturer Part Number: CAT16-1002F4LF; Category: Res; Termination: Concave; Series: CAT16; Height: 0.6mm; Device Class L2: Resistors; Digikey Description: RES ARRAY 4 RES 10K OHM 1206; ComponentLink2Description: Datasheet; Temperature Range High: +125°C; ComponentLink2URL: https://www.bourns.com/docs/Product-Datasheets/CATCAY.pdf; Temperature: -55°C to +125°C; Temperature Range Low: -55°C; Octopart: https://octopart.com/cat16-1002f4lf-bourns-1624551; Mouser Description: Resistor Networks & Arrays 10K 1% Concave 4resistors; RoHS: TRUE; Device Class L1: Passive Components; Lead Free: Yes; Automotive: No; Package: CAT16-F4; Device Class L3: Resistor Arrays
U2 = FE1.1S: USB 2.0 HIGH SPEED 4-PORT HUB CONTROLLER; Manufacturer: Terminus Technology Inc; value: FE1.1S; Case/Package: SSOP-28; Category: IC
X9 = CMP-2000-06794-1: Male Header, Pitch 2.54 mm, 2 x 5 Postion, Height 9.91 mm, Tail Length 2.84 mm, -55 to 105 degC, RoHS, Bulk; PartNumber: N2510; Manufacturer: 3M; Pitch: 2.54mm; value: 10-Pin Shrouded Header, 2.54mm; Manufacturer Part Number: N2510-6002RB; Case/Package: IDC-10; Category: Connector

## Sheet ESP32.SchDoc
size A3; SheetNumber: 11; SheetTotal: 15
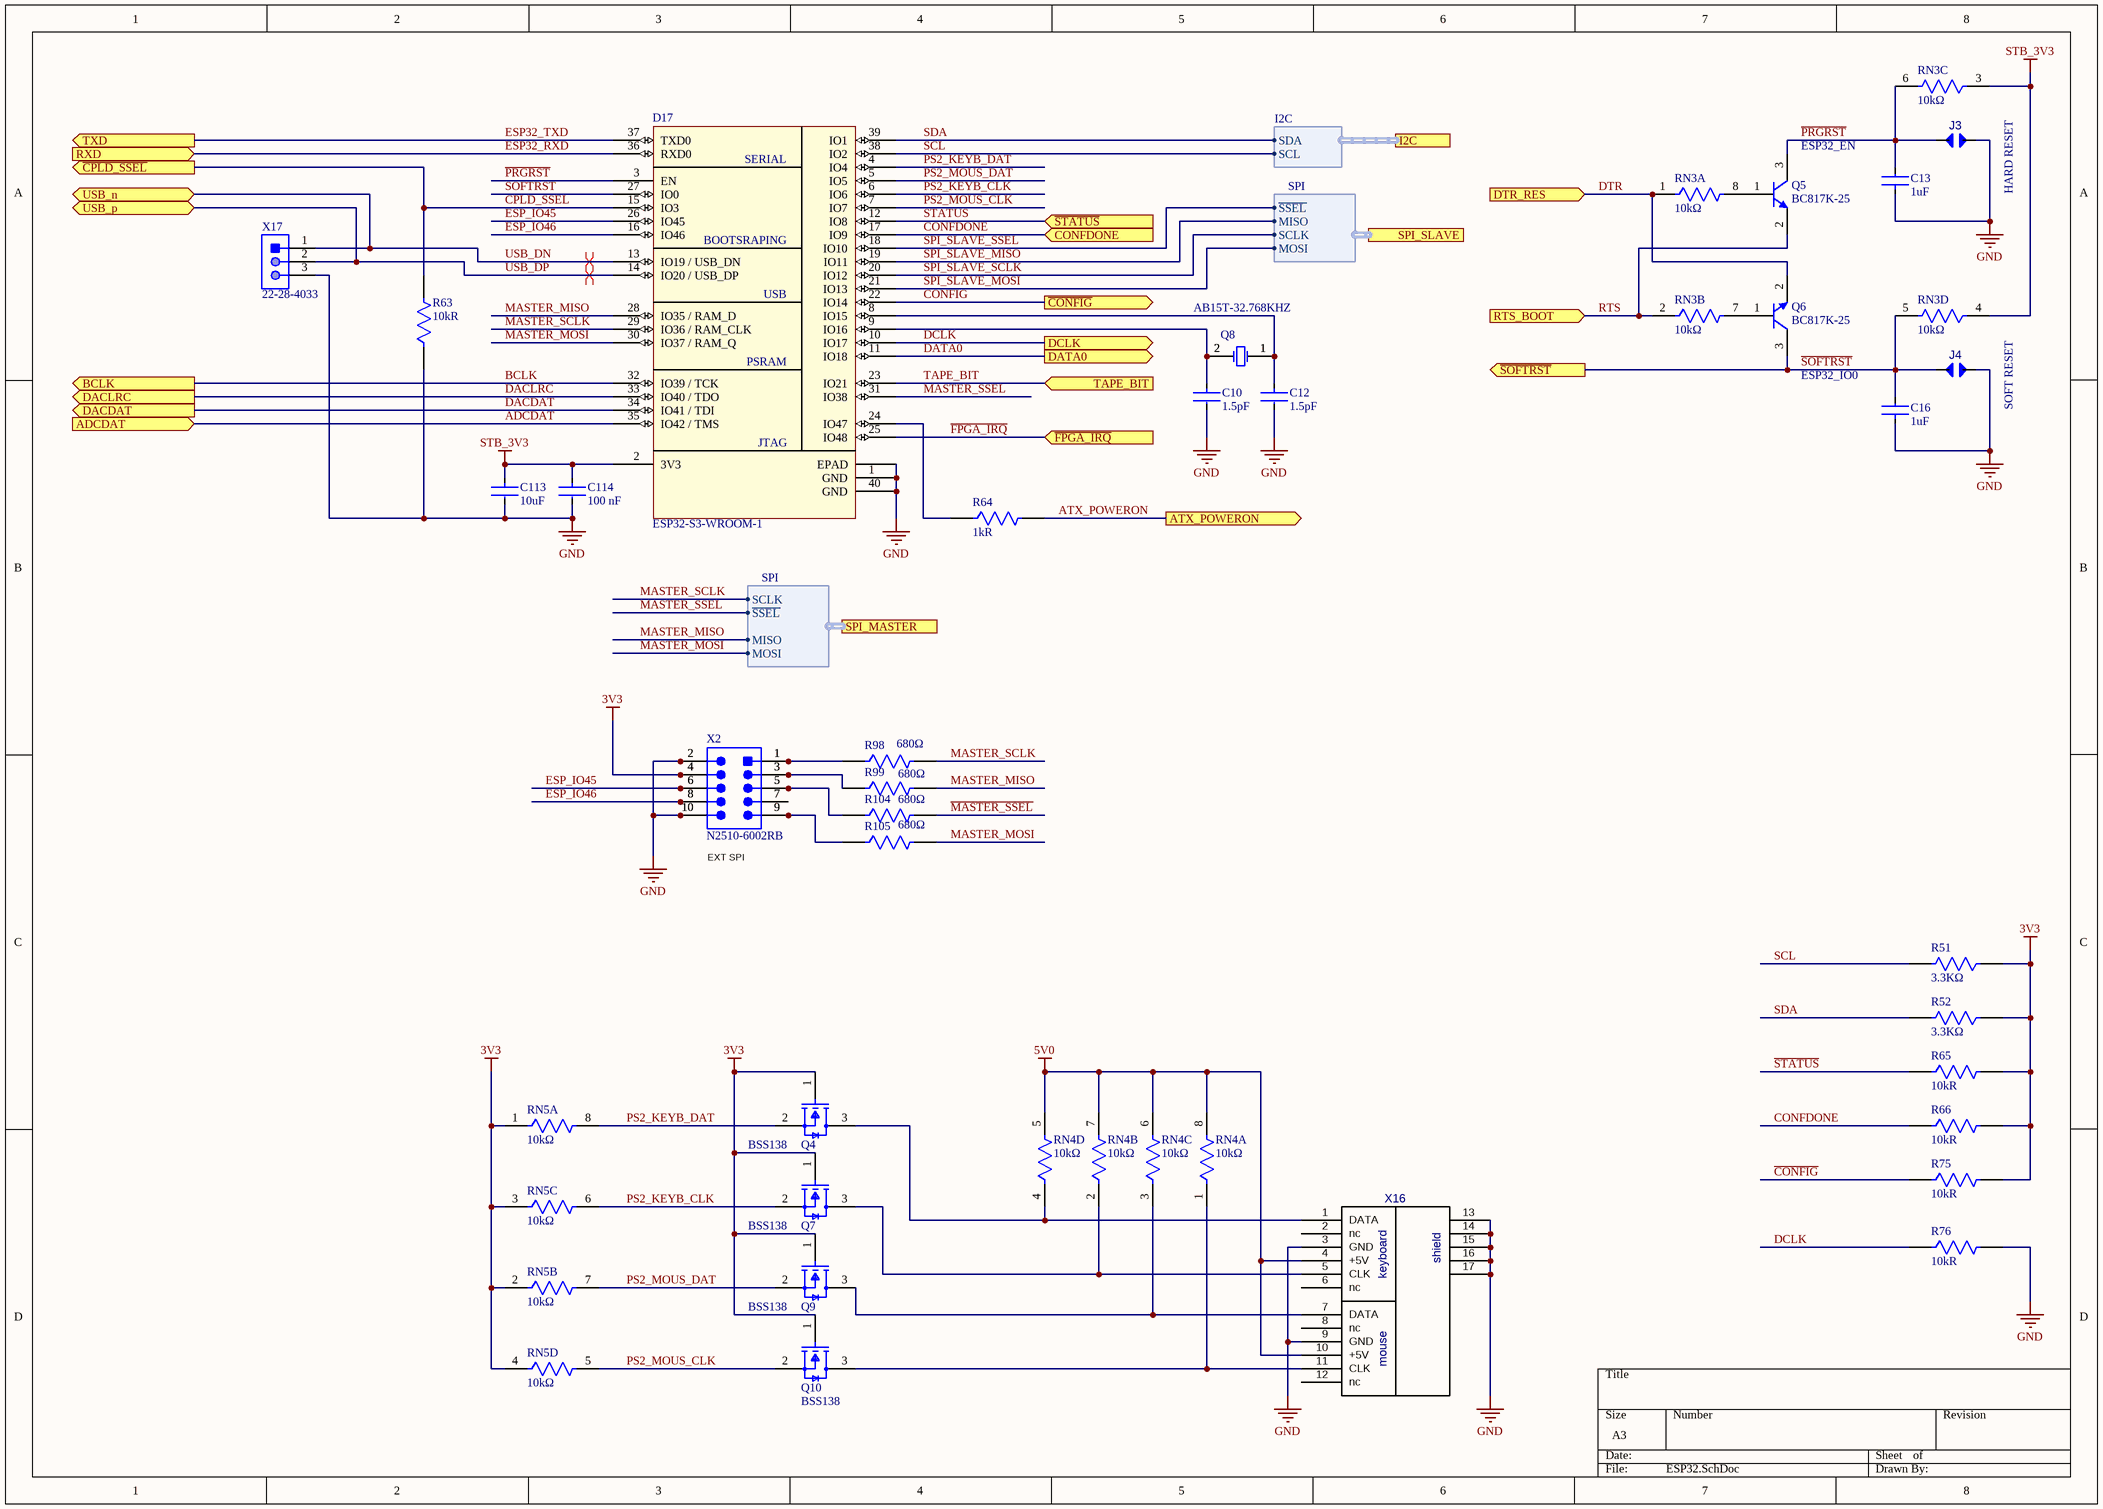
[diagram p10: ESP32.SchDoc]

### Parts
C10  Capacitance: 1.5pF  [FP-CL21-IPC_A]  (hidden comment: CL21C1R5CBANNNC)
C12  Capacitance: 1.5pF  [FP-CL21-IPC_A]  (hidden comment: CL21C1R5CBANNNC)
C13  Capacitance: 1uF  [FP-GCM21B-0_15-IPC_A]  (hidden comment: GCM21BR71E105KA56L)
C16  Capacitance: 1uF  [FP-GCM21B-0_15-IPC_A]  (hidden comment: GCM21BR71E105KA56L)
C113  Capacitance: 10uF  [FP-C0805C-DG-IPC_A]  (hidden comment: C0805C106K8PACTU)
C114  Capacitance: 100 nF  [FP-CC0805-0_85-IPC_A]  (hidden comment: CC0805KRX7R9BB104)
D17  ESP32-S3-WROOM-1  [ESP32S3WROOM1]
J3  JUMPER  [JUMPER_JUMPER(Primary)]  (value not drawn)
J4  JUMPER  [JUMPER_JUMPER(Primary)]  (value not drawn)
Q4  BSS138  [FP-318-08-IPC_B]
Q5  BC817K-25  [INF-SOT23_N]
Q6  BC817K-25  [INF-SOT23_N]
Q7  BSS138  [FP-318-08-IPC_B]
Q8  AB15T-32.768KHZ  [ABRA-AB15T-2_V]
Q9  BSS138  [FP-318-08-IPC_B]
Q10  BSS138  [FP-318-08-IPC_B]
R51  Resistance: 3.3KΩ  [FP-RT0805-IPC_A]  (hidden comment: RT0805FRE073K3L)
R52  Resistance: 3.3KΩ  [FP-RT0805-IPC_A]  (hidden comment: RT0805FRE073K3L)
R63  Resistance: 10kR  [FP-CR0805-IPC_A]  (hidden comment: CR0805-JW-103ELF)
R64  Resistance: 1kR  [FP-MCR10-IPC_A]  (hidden comment: MCR10ERTJ102)
R65  Resistance: 10kR  [FP-CR0805-IPC_A]  (hidden comment: CR0805-JW-103ELF)
R66  Resistance: 10kR  [FP-CR0805-IPC_A]  (hidden comment: CR0805-JW-103ELF)
R75  Resistance: 10kR  [FP-CR0805-IPC_A]  (hidden comment: CR0805-JW-103ELF)
R76  Resistance: 10kR  [FP-CR0805-IPC_A]  (hidden comment: CR0805-JW-103ELF)
R98  value 680Ω  [FP-RT0805-IPC_A]  (hidden comment: RT0805FRE07680RL)
R99  value 680Ω  [FP-RT0805-IPC_A]  (hidden comment: RT0805FRE07680RL)
R104  value 680Ω  [FP-RT0805-IPC_A]  (hidden comment: RT0805FRE07680RL)
R105  value 680Ω  [FP-RT0805-IPC_A]  (hidden comment: RT0805FRE07680RL)
RN3  Resistance: 10kΩ  [FP-CAT16-F4-MFG]  (hidden comment: CAT16-1002F4LF)  (parts A,B,C,D of 4)
RN4  Resistance: 10kΩ  [FP-CAT16-F4-MFG]  (hidden comment: CAT16-1002F4LF)  (parts A,B,C,D of 4)
RN5  Resistance: 10kΩ  [FP-CAT16-F4-MFG]  (hidden comment: CAT16-1002F4LF)  (parts A,B,C,D of 4)
X2  N2510-6002RB  [3M-N2510-6002-10_V]
X16  KEYB-MOUSE  [MDD-6FR]  (value not drawn)
X17  22-28-4033  [MOLX-22-28-4033_V]

### Ports
ADCDAT (in), ATX_POWERON (out), BCLK (out), CONFDONE (in), DACDAT (out), DACLRC (out), DATA0 (out), DCLK (out), DTR_RES (in), I2C (harness I2C), RTS_BOOT (in), RXD (in), SPI_MASTER (harness SPI), SPI_SLAVE (harness SPI), TAPE_BIT (in), TXD (out), USB_n (bidir), USB_p (bidir), ~{CONFIG} (out), ~{CPLD_SSEL} (out), ~{FPGA_IRQ} (in), ~{SOFTRST} (out), ~{STATUS} (in)

### Harnesses
SPI: ~{SSEL}, SCLK, MOSI, MISO
I2C: SDA, SCL

### Nets
3V3: Q4.1(G) Q7.1(G) Q9.1(G) Q10.1(G) R51.1 R52.1 R65.2 R66.2 R75.2 RN5.1 RN5.2 RN5.3 RN5.4 X2.4
5V0: RN4.5 RN4.6 RN4.7 RN4.8 X16.4(+5V) X16.10(+5V)
GND: C10.2 C12.2 C13.1 C16.1 C113.2 C114.2 D17.1(GND) D17.40(GND) D17.EPAD J3.1 J4.1 R63.1 R76.2 X2.2 X2.10 X16.3(GND) X16.9(GND) X16.13(shield) X16.14(shield) X16.15(shield) X16.16(shield) X16.17(shield) X17.3
STB_3V3: C113.1 C114.1 D17.2(3V3) RN3.3 RN3.4
ADCDAT: D17.35(IO42_/_TMS) ; port ADCDAT
ATX_POWERON: R64.2 ; port ATX_POWERON
BCLK: D17.32(IO39_/_TCK) ; port BCLK
~{CONFIG}: D17.22(IO14) R75.1 ; port ~{CONFIG}
~{CPLD_SSEL}: D17.15(IO3) R63.2 ; port ~{CPLD_SSEL}
CONFDONE: D17.17(IO9) R66.1 ; port CONFDONE
DACDAT: D17.34(IO41_/_TDI) ; port DACDAT
DACLRC: D17.33(IO40_/_TDO) ; port DACLRC
DATA0: D17.11(IO18) ; port DATA0
DCLK: D17.10(IO17) R76.1 ; port DCLK
DTR: Q6.2(E) RN3.1 ; port DTR_RES
ESP32_RXD: D17.36(RXD0) ; port RXD
ESP32_TXD: D17.37(TXD0) ; port TXD
ESP_IO45: D17.26(IO45) X2.6  [project net ESP_IO45_11]
ESP_IO46: D17.16(IO46) X2.8  [project net ESP_IO46_11]
~{FPGA_IRQ}: D17.25(IO48) ; port ~{FPGA_IRQ}  [project net ~{SPI_SLAVE_IRQ}]
~{MASTER_SSEL}: D17.31(IO38) R104.2 ; port SPI_MASTER.~{SSEL}  [project net ESP32_MASTER.~{SSEL}]
MASTER_MISO: D17.28(IO35_/_RAM_D) R99.2 ; port SPI_MASTER.MISO  [project net ESP32_MASTER.MISO]
MASTER_MOSI: D17.30(IO37_/_RAM_Q) R105.2 ; port SPI_MASTER.MOSI  [project net ESP32_MASTER.MOSI]
MASTER_SCLK: D17.29(IO36_/_RAM_CLK) R98.2 ; port SPI_MASTER.SCLK  [project net ESP32_MASTER.SCLK]
~{PRGRST}: C13.2 D17.3(EN) J3.0 Q5.3(C) RN3.6  [project net ~{PRGRST}_11]
PS2_KEYB_CLK: D17.6(IO6) Q7.2(S) RN5.6  [project net PS2_KEYB_CLK_11]
PS2_KEYB_DAT: D17.4(IO4) Q4.2(S) RN5.8  [project net PS2_KEYB_DAT_11]
PS2_MOUS_CLK: D17.7(IO7) Q10.2(S) RN5.5  [project net PS2_MOUS_CLK_11]
PS2_MOUS_DAT: D17.5(IO5) Q9.2(S) RN5.7  [project net PS2_MOUS_DAT_11]
RTS: Q5.2(E) RN3.2 ; port RTS_BOOT
~{SOFTRST}: C16.2 D17.27(IO0) J4.0 Q6.3(C) RN3.5 ; port ~{SOFTRST}
~{SPI_SLAVE_SSEL}: D17.18(IO10) ; port SPI_SLAVE.~{SSEL}  [project net ESP32_SLAVE.~{SSEL}]
~{STATUS}: D17.12(IO8) R65.1 ; port ~{STATUS}
SCL: D17.38(IO2) R51.2 ; port I2C.SCL  [project net I2C.SCL]
SDA: D17.39(IO1) R52.2 ; port I2C.SDA  [project net I2C.SDA]
SPI_SLAVE_MISO: D17.19(IO11) ; port SPI_SLAVE.MISO  [project net ESP32_SLAVE.MISO]
SPI_SLAVE_MOSI: D17.21(IO13) ; port SPI_SLAVE.MOSI  [project net ESP32_SLAVE.MOSI]
SPI_SLAVE_SCLK: D17.20(IO12) ; port SPI_SLAVE.SCLK  [project net ESP32_SLAVE.SCLK]
TAPE_BIT: D17.23(IO21) ; port TAPE_BIT
USB_DN: D17.13(IO19_/_USB_DN) X17.1 ; port USB_n  [project net USB_n]
USB_DP: D17.14(IO20_/_USB_DP) X17.2 ; port USB_p  [project net USB_p]
NetC10_1: C10.1 D17.9(IO16) Q8.2(X2)
NetC12_1: C12.1 D17.8(IO15) Q8.1(X1)
NetD17_24: D17.24(IO47) R64.1
NetQ4_3: Q4.3(D) RN4.4 X16.1(DATA)
NetQ5_1: Q5.1(B) RN3.8
NetQ6_1: Q6.1(B) RN3.7
NetQ7_3: Q7.3(D) RN4.2 X16.5(CLK)
NetQ9_3: Q9.3(D) RN4.3 X16.7(DATA)
NetQ10_3: Q10.3(D) RN4.1 X16.11(CLK)
NetR98_1: R98.1 X2.1
NetR99_1: R99.1 X2.3
NetR104_1: R104.1 X2.5
NetR105_1: R105.1 X2.9

Not connected (* = marked no-connect by the designer): X2 7; X16 2(nc) 6(nc) 8(nc) 12(nc)

### Layout directives
differential pair: USB_n, USB_p

### Notes on the sheet
- (near Q5) ESP32_EN
- HARD RESET
- ESP32_IO0
- SOFT RESET
- (near X2) EXT SPI
- (in symbol ESP32-S3-WROOM-1) SERIAL; BOOTSRAPING; USB; PSRAM; JTAG
- (in symbol KEYB-MOUSE) keyboard; mouse

### Library data of the parts
C10 C12 = CMP-13271-001925-1: CL21 Series 0805 1.5pF 50V ±0.25pF Tolerance C0G Multilayer Ceramic Chip Capacitor; Manufacturer: Samsung; Case/Package: 0805; Manufacturer Part Number: CL21C1R5CBANNNC; value: 1.5pF; Category: Cap
C13 C16 = CMP-2007-03346-2: Ceramic Capacitor for Automotive 1uF ±10% 25VDC X7R 0805 Embossed T/R; Manufacturer: Murata; Termination: SMD/SMT; Case/Package: 0805; Manufacturer Part Number: GCM21BR71E105KA56L; value: 1uF; Category: Cap
C113 = CMP-2007-03243-2: as C40 on sheet Power ATX; Manufacturer Part Number: C0805C106K8PACTU; Value: 10uF; Category: Cap; Case/Package: 0805
C114 = CMP-2100-03606-3: as C50 on sheet Power ATX; Category: Cap; Manufacturer Part Number: CC0805KRX7R9BB104; Case/Package: 0805
D17 = ESP32-S3-WROOM-1: 2.4 GHz Wi­Fi (802.11 b/g/n) and Bluetooth® 5 (LE) module / Built around ESP32­S3 series of SoCs, Xtensa® dual­core 32­bit LX7 microprocessor / Flash up to 16 MB, PSRAM up to 8 MB / 36 GPIOs, rich set of peripherals / Onboard PCB antenna or external antenna connector; value: ESP32-S3-WROOM-1; Case/Package: ESP32-S3; Category: IC
J3 J4 = JUMPER: HLT->~IP; Value: PLS-2; Case/Package: PLS-2; Category: Connector
Q4 Q7 Q9 Q10 = CMP-07173-000101-1: MOSFET N-CH 50V 220MA SOT-23; Manufacturer: ON Semiconductor / Fairchild; Number of Pins: 3; Case/Package: SOT-23; Termination: SMD/SMT; Manufacturer Part Number: BSS138; value: BSS138; Category: Transistor
Q5 Q6 = CMP-1177-00027-1: as VT1 on sheet Power ATX; PackageDescription: 3-Pin Small Outline Transistor Package, 1.3 x 2.9 mm Body, 0.95 mm Pitch; PartNumber: BC817K-25; Manufacturer Part Number: BC817K-25; value: BC817K-25; Case/Package: SOT-23; Category: Transistor
Q8 = CMP-1326-00001-1: Low Frequency Cylindrical Watch Crystal, 32.768 kHz, -20 to 70 degC, 2-Pin 5 x 1.4 x 1.5 mm THD, RoHS, Bulk; Manufacturer: Abracon; PackageDescription: 2-Pin THD, Body 5 x 1.4 mm, Pin Spacing 0.45 mm; PartNumber: AB15T-32.768KHZ; Manufacturer Part Number: AB15T-32.768KHZ; value: AB15T-32.768KHZ; Category: CrystalsandOscillators
R51 R52 = CMP-03412-025935-1: RES SMD 3.3K OHM 1% 1/8W 0805; Manufacturer: Yageo; Value: 3.3KΩ; Manufacturer Part Number: RT0805FRE073K3L; Category: Res; Case/Package: 0805
R63 R65 R66 R75 R76 = CMP-07231-003873-1: as R127 on sheet Power ATX; value: 10kΩ; Manufacturer Part Number: CR0805-JW-103ELF; Number of Terminations: 2; Termination: SMD/SMT; Number of Pins: 2; Case/Package: 0805; Category: Res
R64 = CMP-08839-004390-1: Thick Film Chip Resistor, 0805, 1kΩ, 5%, 200ppm/°C, 0.125W, 150V; Manufacturer: Rohm; Case/Package: 0805; Number of Terminations: 2; Manufacturer Part Number: MCR10ERTJ102; value: 1kΩ; Category: Res
R98 R99 R104 R105 = CMP-03412-000082-1: RES SMD 680 OHM 1% 1/8W 0805; Manufacturer: Yageo; Category: Res; Manufacturer Part Number: RT0805FRE07680RL; Resistance: 680Ω; Case/Package: 0805
RN3-RN5 = CMP-07230-000003-1: as RN7 on sheet Power ATX; Manufacturer Part Number: CAT16-1002F4LF; Category: Res; Termination: Concave; Series: CAT16; Height: 0.6mm; Device Class L2: Resistors; Digikey Description: RES ARRAY 4 RES 10K OHM 1206; ComponentLink2Description: Datasheet; Temperature Range High: +125°C; ComponentLink2URL: https://www.bourns.com/docs/Product-Datasheets/CATCAY.pdf; Temperature: -55°C to +125°C; Temperature Range Low: -55°C; Octopart: https://octopart.com/cat16-1002f4lf-bourns-1624551; Mouser Description: Resistor Networks & Arrays 10K 1% Concave 4resistors; RoHS: TRUE; Device Class L1: Passive Components; Lead Free: Yes; Automotive: No; Package: CAT16-F4; Device Class L3: Resistor Arrays
X2 = CMP-2000-06794-1: as X9 on sheet USB; Manufacturer Part Number: N2510-6002RB; Case/Package: IDC-10; Category: Connector
X17 = CMP-1676-00001-5: Male Header, Pitch 2.54 mm, 1 x 3 Position, Height 8.38 mm, Tail Length 3.18 mm, RoHS, Bulk; Manufacturer: Molex; value: header 3 pin, 2.54mm; PackageDescription: Male Header, Pitch 2.54 mm, 1 x 3 Position, Height 8.38 mm, Tail Length 3.18 mm; Manufacturer Part Number: 22-28-4033; Case/Package: PLS-3; Category: Connector
X16 = KEYB-MOUSE: Value: KEYB-MOUSE; Case/Package: Stacked Mini DIN; Category: Connector

## Sheet AY Amp.SchDoc
size A3; SheetNumber: 3; SheetTotal: 15
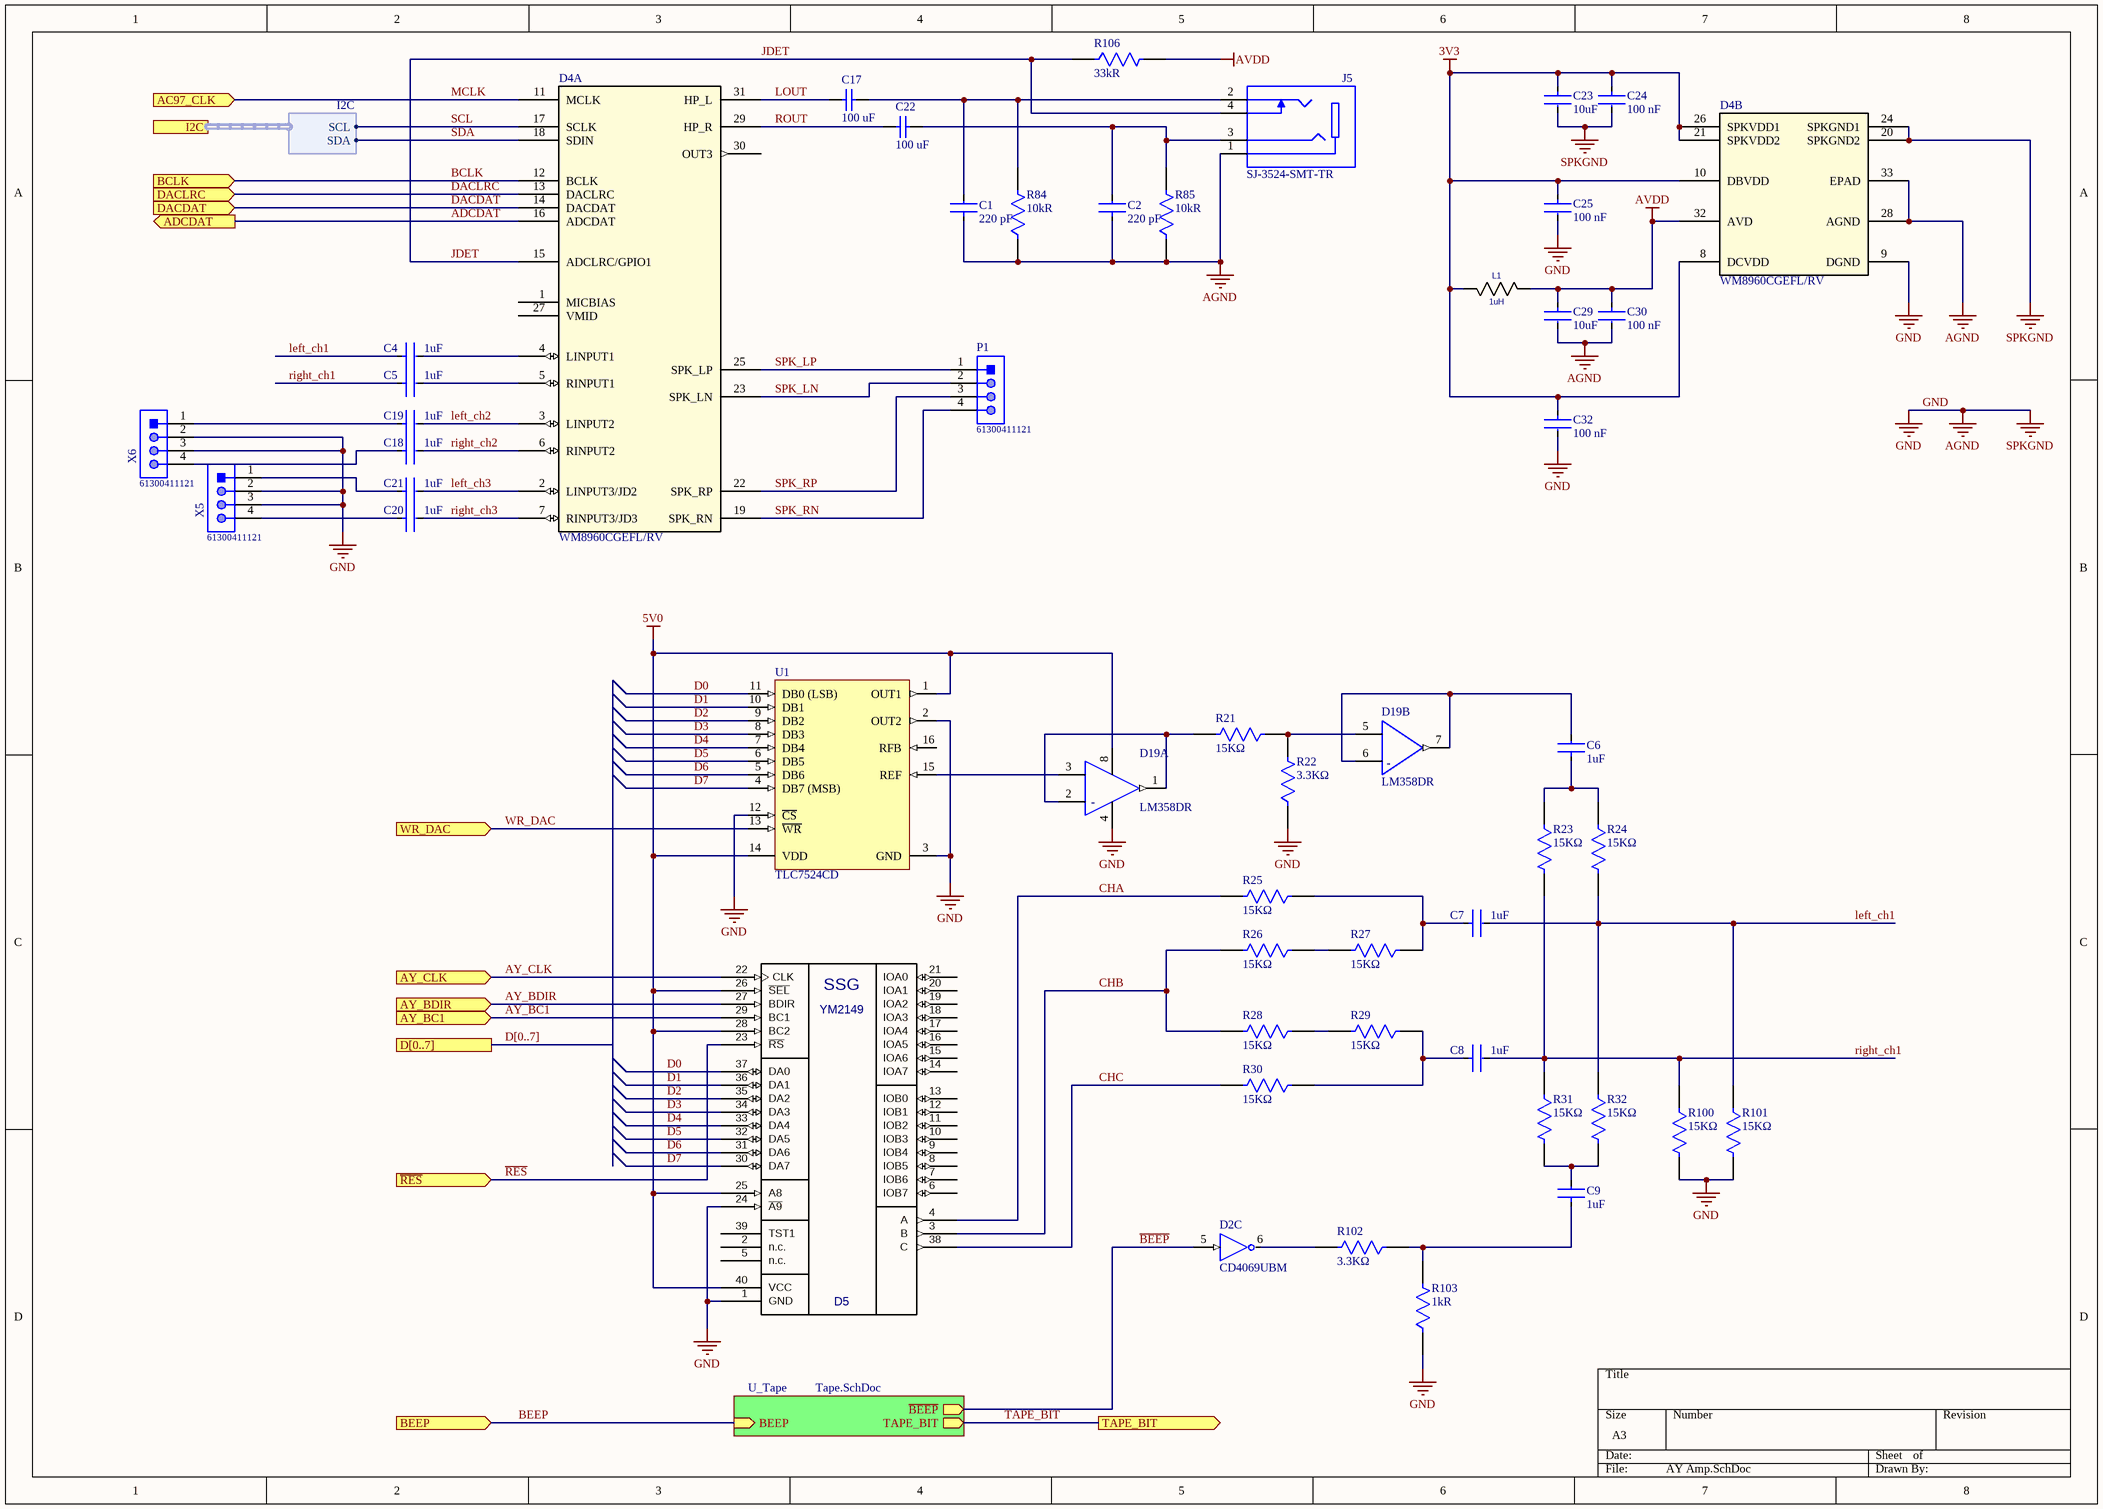
[diagram p11: AY Amp.SchDoc]

### Parts
C1  Capacitance: 220 pF  [FP-CC0805-0_85-IPC_A]  (hidden comment: CC0805KRX7R9BB221)
C2  Capacitance: 220 pF  [FP-CC0805-0_85-IPC_A]  (hidden comment: CC0805KRX7R9BB221)
C4  Capacitance: 1uF  [FP-GCM21B-0_15-IPC_A]  (hidden comment: GCM21BR71E105KA56L)
C5  Capacitance: 1uF  [FP-GCM21B-0_15-IPC_A]  (hidden comment: GCM21BR71E105KA56L)
C6  Capacitance: 1uF  [FP-GCM21B-0_15-IPC_A]  (hidden comment: GCM21BR71E105KA56L)
C7  Capacitance: 1uF  [FP-GCM21B-0_15-IPC_A]  (hidden comment: GCM21BR71E105KA56L)
C8  Capacitance: 1uF  [FP-GCM21B-0_15-IPC_A]  (hidden comment: GCM21BR71E105KA56L)
C9  Capacitance: 1uF  [FP-GCM21B-0_15-IPC_A]  (hidden comment: GCM21BR71E105KA56L)
C17  Capacitance: 100 uF  [CAPC3216X190X55ML30T25]  (hidden comment: GRM31CR60J107ME39L)
C18  Capacitance: 1uF  [FP-GCM21B-0_15-IPC_A]  (hidden comment: GCM21BR71E105KA56L)
C19  Capacitance: 1uF  [FP-GCM21B-0_15-IPC_A]  (hidden comment: GCM21BR71E105KA56L)
C20  Capacitance: 1uF  [FP-GCM21B-0_15-IPC_A]  (hidden comment: GCM21BR71E105KA56L)
C21  Capacitance: 1uF  [FP-GCM21B-0_15-IPC_A]  (hidden comment: GCM21BR71E105KA56L)
C22  Capacitance: 100 uF  [CAPC3216X190X55ML30T25]  (hidden comment: GRM31CR60J107ME39L)
C23  Capacitance: 10uF  [FP-C0805C-DG-IPC_A]  (hidden comment: C0805C106K8PACTU)
C24  Capacitance: 100 nF  [FP-CC0805-0_85-IPC_A]  (hidden comment: CC0805KRX7R9BB104)
C25  Capacitance: 100 nF  [FP-CC0805-0_85-IPC_A]  (hidden comment: CC0805KRX7R9BB104)
C29  Capacitance: 10uF  [FP-C0805C-DG-IPC_A]  (hidden comment: C0805C106K8PACTU)
C30  Capacitance: 100 nF  [FP-CC0805-0_85-IPC_A]  (hidden comment: CC0805KRX7R9BB104)
C32  Capacitance: 100 nF  [FP-CC0805-0_85-IPC_A]  (hidden comment: CC0805KRX7R9BB104)
D2  CD4069UBM  [FP-D0014A-IPC_A]  (part C of 7)
D4  WM8960CGEFL/RV  [QFN50P500X500X90_HS-33M]  (parts A,B of 2)
D5  YM2149  [DIP40]
D19  LM358DR  [FP-D0008A-MFG]  (parts A,B of 2)
J5  SJ-3524-SMT-TR  [SJ-3524-SMT-TR]
L1  value 1uH  [L-CHIP]  (hidden comment: L-CHIP)
P1  61300411121  [61300411121]
R21  Resistance: 15KΩ  [FP-RN732A-IPC_A]  (hidden comment: RN73C2A15KBTDF)
R22  Resistance: 3.3KΩ  [FP-RT0805-IPC_A]  (hidden comment: RT0805FRE073K3L)
R23  Resistance: 15KΩ  [FP-RN732A-IPC_A]  (hidden comment: RN73C2A15KBTDF)
R24  Resistance: 15KΩ  [FP-RN732A-IPC_A]  (hidden comment: RN73C2A15KBTDF)
R25  Resistance: 15KΩ  [FP-RN732A-IPC_A]  (hidden comment: RN73C2A15KBTDF)
R26  Resistance: 15KΩ  [FP-RN732A-IPC_A]  (hidden comment: RN73C2A15KBTDF)
R27  Resistance: 15KΩ  [FP-RN732A-IPC_A]  (hidden comment: RN73C2A15KBTDF)
R28  Resistance: 15KΩ  [FP-RN732A-IPC_A]  (hidden comment: RN73C2A15KBTDF)
R29  Resistance: 15KΩ  [FP-RN732A-IPC_A]  (hidden comment: RN73C2A15KBTDF)
R30  Resistance: 15KΩ  [FP-RN732A-IPC_A]  (hidden comment: RN73C2A15KBTDF)
R31  Resistance: 15KΩ  [FP-RN732A-IPC_A]  (hidden comment: RN73C2A15KBTDF)
R32  Resistance: 15KΩ  [FP-RN732A-IPC_A]  (hidden comment: RN73C2A15KBTDF)
R84  Resistance: 10kR  [FP-CR0805-IPC_A]  (hidden comment: CR0805-JW-103ELF)
R85  Resistance: 10kR  [FP-CR0805-IPC_A]  (hidden comment: CR0805-JW-103ELF)
R100  Resistance: 15KΩ  [FP-RN732A-IPC_A]  (hidden comment: RN73C2A15KBTDF)
R101  Resistance: 15KΩ  [FP-RN732A-IPC_A]  (hidden comment: RN73C2A15KBTDF)
R102  Resistance: 3.3KΩ  [FP-RT0805-IPC_A]  (hidden comment: RT0805FRE073K3L)
R103  Resistance: 1kR  [FP-CRCW0805-HPe3-IPC_A]  (hidden comment: CRCW08051K00FKEAHP)
R106  Resistance: 33kR  [FP-RMCF0805-IPC_A]  (hidden comment: RMCF0805JT33K0)
U1  TLC7524CD  [TI-D16_N]
X5  61300411121  [61300411121]
X6  61300411121  [61300411121]

### Sub-sheets
U_Tape = Tape.SchDoc: BEEP (in), TAPE_BIT (out), ~{BEEP} (out)

### Ports
AC97_CLK (in), ADCDAT (out), AY_BC1 (in), AY_BDIR (in), AY_CLK (in), BCLK (in), BEEP (in), D[0..7], DACDAT (in), DACLRC (in), I2C (harness I2C), TAPE_BIT (out), WR_DAC (in), ~{RES} (in)

### Harnesses
I2C: SDA, SCL

### Nets
3V3: C23.1 C24.1 C25.1 C32.1 D4.8(DCVDD) D4.10(DBVDD) D4.21(SPKVDD2) D4.26(SPKVDD1) L1.2
5V0: D5.25(A8) D5.26(~{SEL}) D5.28(BC2) D5.40(VCC) D19.8(V+) U1.1(OUT1) U1.14(VDD)
AVDD: C29.1 C30.1 D4.32(AVD) L1.1 R106.2
GND: C1.1 C2.1 C23.2 C24.2 C25.2 C29.2 C30.2 C32.2 D4.9(DGND) D4.20(SPKGND2) D4.24(SPKGND1) D4.28(AGND) D4.33(EPAD) D5.1(GND) D5.24(~{A9}) D19.4(V-) J5.1 R22.1 R84.1 R85.1 R100.2 R101.2 R103.1 U1.2(OUT2) U1.3(GND) U1.12(~{CS}) X5.2 X5.3 X6.2 X6.3  [also labelled AGND, SPKGND]
ADCDAT: D4.16(ADCDAT) ; port ADCDAT
AY_BC1: D5.29(BC1) ; port AY_BC1
AY_BDIR: D5.27(BDIR) ; port AY_BDIR
AY_CLK: D5.22(CLK) ; port AY_CLK
~{BEEP}: D2.5(C) ; sheet U_Tape/~{BEEP}
BCLK: D4.12(BCLK) ; port BCLK
BEEP: port BEEP, sheet U_Tape/BEEP
CHA: D5.4(A) R25.2  [project net CHA_3]
CHB: D5.3(B) R26.2 R28.2  [project net CHB_3]
CHC: D5.38(C) R30.2  [project net CHC_3]
D0: D5.37(DA0) U1.11(DB0_(LSB))
D1: D5.36(DA1) U1.10(DB1)
D2: D5.35(DA2) U1.9(DB2)
D3: D5.34(DA3) U1.8(DB3)
D4: D5.33(DA4) U1.7(DB4)
D5: D5.32(DA5) U1.6(DB5)
D6: D5.31(DA6) U1.5(DB6)
D7: D5.30(DA7) U1.4(DB7_(MSB))
DACDAT: D4.14(DACDAT) ; port DACDAT
DACLRC: D4.13(DACLRC) ; port DACLRC
JDET: D4.15(ADCLRC/GPIO1) J5.4 R106.1  [project net JDET_3]
left_ch1: C4.1 C7.2 R24.2 R32.1 R101.1  [project net left_ch1_3]
left_ch2: C19.2 D4.3(LINPUT2)  [project net left_ch2_3]
left_ch3: C21.2 D4.2(LINPUT3/JD2)  [project net left_ch3_3]
LOUT: C17.1 D4.31(HP_L)  [project net LOUT_3]
MCLK: D4.11(MCLK) ; port AC97_CLK  [project net AC97_CLK]
~{RES}: D5.23(~{RS}) ; port ~{RES}
right_ch1: C5.1 C8.2 R23.2 R31.1 R100.1  [project net right_ch1_3]
right_ch2: C18.2 D4.6(RINPUT2)  [project net right_ch2_3]
right_ch3: C20.2 D4.7(RINPUT3/JD3)  [project net right_ch3_3]
ROUT: C22.1 D4.29(HP_R)  [project net ROUT_3]
SCL: D4.17(SCLK) ; port I2C.SCL  [project net I2C.SCL]
SDA: D4.18(SDIN) ; port I2C.SDA  [project net I2C.SDA]
SPK_LN: D4.23(SPK_LN) P1.2  [project net SPK_LN_3]
SPK_LP: D4.25(SPK_LP) P1.1  [project net SPK_LP_3]
SPK_RN: D4.19(SPK_RN) P1.4  [project net SPK_RN_3]
SPK_RP: D4.22(SPK_RP) P1.3  [project net SPK_RP_3]
TAPE_BIT: port TAPE_BIT, sheet U_Tape/TAPE_BIT
WR_DAC: U1.13(~{WR}) ; port WR_DAC  [project net WRDAC]
NetC1_2: C1.2 C17.2 J5.2 R84.2
NetC2_2: C2.2 C22.2 J5.3 R85.2
NetC4_2: C4.2 D4.4(LINPUT1)
NetC5_2: C5.2 D4.5(RINPUT1)
NetC6_1: C6.1 R23.1 R24.1
NetC6_2: C6.2 D19.6(IN2-) D19.7(2OUT)
NetC7_1: C7.1 R25.1 R27.1
NetC8_1: C8.1 R29.1 R30.1
NetC9_1: C9.1 R102.1 R103.2
NetC9_2: C9.2 R31.2 R32.2
NetC18_1: C18.1 X6.4
NetC19_1: C19.1 X6.1
NetC20_1: C20.1 X5.4
NetC21_1: C21.1 X5.1
NetD2_6: D2.6(~{C}) R102.2
NetD19_1: D19.1(1OUT) D19.2(IN1-) R21.2
NetD19_3: D19.3(IN1+) U1.15(REF)
NetD19_5: D19.5(IN2+) R21.1 R22.2
NetR26_1: R26.1 R27.2
NetR28_1: R28.1 R29.2

Not connected (* = marked no-connect by the designer): D4 1(MICBIAS) 27(VMID) 30(OUT3); D5 2(n.c.) 5(n.c.) 6(IOB7) 7(IOB6) 8(IOB5) 9(IOB4) 10(IOB3) 11(IOB2) 12(IOB1) 13(IOB0) 14(IOA7) 15(IOA6) 16(IOA5) 17(IOA4) 18(IOA3) 19(IOA2) 20(IOA1) 21(IOA0) 39(TST1); U1 16(RFB)

### Buses and harness runs
bus D[0..7] = port D[0..7]

### Notes on the sheet
- (in symbol CMP-1685-00009-2, part A) -
- (in symbol CMP-1685-00009-2, part B) -
- (in symbol YM2149) SSG
- (in symbol LM358DR, part A) -
- (in symbol LM358DR, part B) -

### Library data of the parts
C1 C2 = CMP-1036-02315-3: as C42 on sheet Power ATX; Value: 220 pF; Category: Cap; Case/Package: 0805
C4-C9 C18-C21 = CMP-2007-03346-2: as C13 on sheet ESP32; Termination: SMD/SMT; Case/Package: 0805; Manufacturer Part Number: GCM21BR71E105KA56L; value: 1uF; Category: Cap
C17 C22 = CMP-1662-00011-2: Chip Capacitor, 100 uF, +/- 20%, 6.3 V, -55 to 85 degC, 1206 (3216 Metric), RoHS, Tape and Reel; Manufacturer: Murata; value: 100 uF; PackageDescription: 2-Pin Surface Mount Device, Body 3.2 x 1.6 mm; PartNumber: GRM31CR60J107ME39L; Manufacturer Part Number: GRM31CR60J107ME39L; Case/Package: 1206; Category: Cap
C23 C29 = CMP-2007-03243-2: as C40 on sheet Power ATX; Manufacturer Part Number: C0805C106K8PACTU; Value: 10uF; Category: Cap; Case/Package: 0805
C24 C25 C30 C32 = CMP-2100-03606-3: as C50 on sheet Power ATX; Category: Cap; Manufacturer Part Number: CC0805KRX7R9BB104; Case/Package: 0805
D2 = CMP-1615-00195-3: IC INVERTER 6CH 6-INP 14SOIC; Manufacturer: Texas Instruments; Number of Pins: 14; Case/Package: SOIC; Manufacturer Part Number: CD4069UBM; value: CD4069UBM; Category: IC
D4 = WM8960CGEFL/RV: Stereo CODEC with 1W Stereo Class-D speaker Drivers; value: WM8960CGEFL/RV; Case/Package: QNF-32; Category: IC
D19 = CMP-1685-00009-2: IC OPAMP GP 2 CIRCUIT 8SOIC; Manufacturer: Texas Instruments; Case/Package: SOIC; Number of Pins: 8; Manufacturer Part Number: LM358DR; value: LM358DR; Category: IC
J5 = SJ-3524-SMT-TR: Connector; Case/Package: Stereo jack smd; Category: Connector; Value: SJ-3524-SMT-TR
P1 X5 X6 = CMP-1502-01064-1: THT Vertical Pin Header WR-PHD, Pitch 2.54 mm, Single Row, 4 pins; Manufacturer: Wurth Electronics; Pitch: 2.54mm; value: header 4 pin 2.54mm; Manufacturer Part Number: 61300411121; Case/Package: PLS-4; Category: Connector
R21 R23-R32 R100 R101 = CMP-03211-008328-1: as R126 on sheet Power ATX; Manufacturer Part Number: RN73C2A15KBTDF; Category: Res; Value: 15KΩ; Case/Package: 0805
R22 R102 = CMP-03412-025935-1: as R51 on sheet ESP32; Manufacturer Part Number: RT0805FRE073K3L; Category: Res; Case/Package: 0805
R84 R85 = CMP-07231-003873-1: as R127 on sheet Power ATX; value: 10kΩ; Manufacturer Part Number: CR0805-JW-103ELF; Number of Terminations: 2; Termination: SMD/SMT; Number of Pins: 2; Case/Package: 0805; Category: Res
R103 = CMP-02407-004529-1: RES Thick Film, 1kΩ, 1%, 0.5W, 100ppm/°C, 0805; Manufacturer: Vishay Dale; Case/Package: 0805; Number of Pins: 2; Termination: Solder; Manufacturer Part Number: CRCW08051K00FKEAHP; value: 1kΩ; Category: Res
R106 = CMP-26527-001097-1: as R124 on sheet Power ATX; Number of Terminations: 2; Case/Package: 0805; Manufacturer Part Number: RMCF0805JT33K0; value: 33kΩ; Category: Res
U1 = CMP-0004-00046-1: 8-Bit, 0.1 us MDAC, Parallel Input, Fast Control Signalling for DSP, Easy Micro Interface, 0 to 70 degC, 16-pin SOIC (D16), Green (RoHS & no Sb/Br); Manufacturer: Texas Instruments; PackageDescription: 16-Pin Plastic Small Outline, Body 9.9 x 3.9 mm, Pitch 1.27 mm; PartNumber: TLC7524CD; Manufacturer Part Number: TLC7524CD; value: TLC7524CD; Case/Package: SOIC-16; Category: IC
D5 = YM2149: Value: YM2149; Case/Package: DIP-40; Category: IC
L1 = L-CHIP: Case/Package: 0805; Category: Inductor

## Sheet Tape.SchDoc
size A4; SheetNumber: 4; SheetTotal: 15
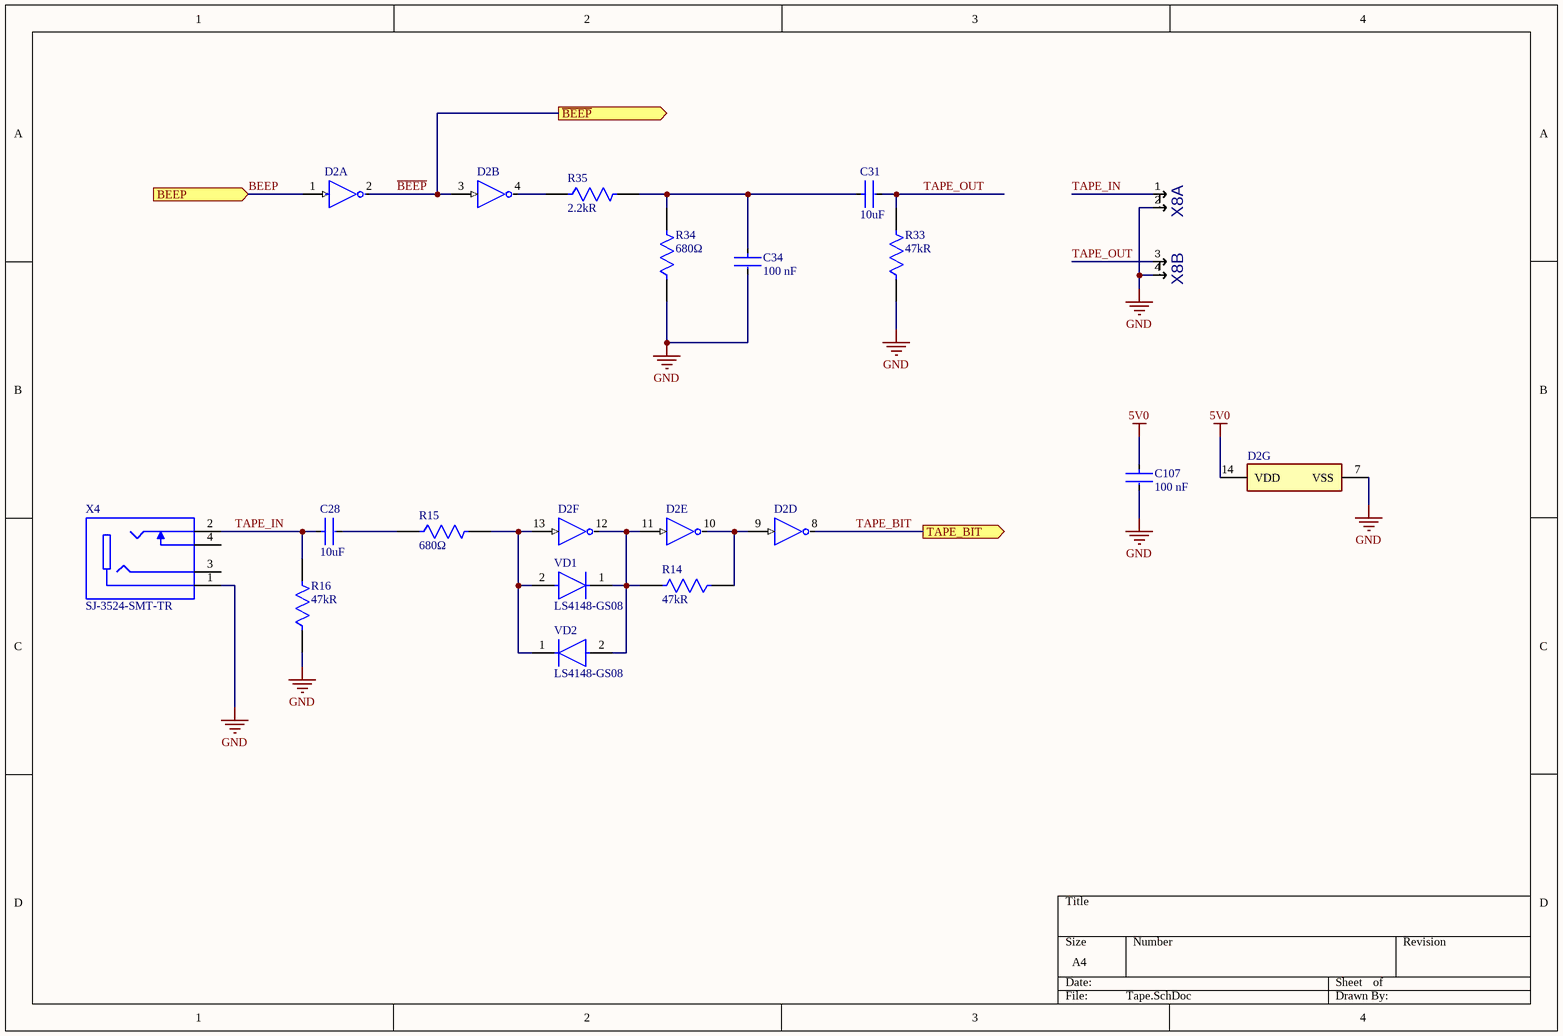
[diagram p12: Tape.SchDoc]

### Parts
C28  Capacitance: 10uF  [FP-C0805C-DG-IPC_A]  (hidden comment: C0805C106K8PACTU)
C31  Capacitance: 10uF  [FP-C0805C-DG-IPC_A]  (hidden comment: C0805C106K8PACTU)
C34  Capacitance: 100 nF  [FP-CC0805-0_85-IPC_A]  (hidden comment: CC0805KRX7R9BB104)
C107  Capacitance: 100 nF  [FP-CC0805-0_85-IPC_A]  (hidden comment: CC0805KRX7R9BB104)
D2  CD4069UBM  [FP-D0014A-IPC_A]  (value not drawn)  (parts A,B,D,E,F,G of 7)
R14  Resistance: 47kR  [FP-CRCW0805-HPe3-IPC_A]  (hidden comment: CRCW080547K0FKEAHP)
R15  value 680Ω  [FP-RT0805-IPC_A]  (hidden comment: RT0805FRE07680RL)
R16  Resistance: 47kR  [FP-CRCW0805-HPe3-IPC_A]  (hidden comment: CRCW080547K0FKEAHP)
R33  Resistance: 47kR  [FP-CRCW0805-HPe3-IPC_A]  (hidden comment: CRCW080547K0FKEAHP)
R34  value 680Ω  [FP-RT0805-IPC_A]  (hidden comment: RT0805FRE07680RL)
R35  Resistance: 2.2kR  [FP-CR0805-IPC_A]  (hidden comment: CR0805-JW-222ELF)
VD1  LS4148-GS08  [FP-6_560-5006_01-4-MFG]
VD2  LS4148-GS08  [FP-6_560-5006_01-4-MFG]
X4  SJ-3524-SMT-TR  [SJ-3524-SMT-TR]
X8  PLB2-2  [PLB2-2]  (value not drawn)  (parts A,B of 2)

### Ports
BEEP (in), TAPE_BIT (out), ~{BEEP} (out)

### Nets
5V0: C107.1 D2.14(VDD)
GND: C34.2 C107.2 D2.7(VSS) R16.1 R33.1 R34.1 X4.1 X8.2 X8.4
~{BEEP}: D2.2(~{A}) D2.3(B) ; port ~{BEEP}
BEEP: D2.1(A) ; port BEEP
TAPE_BIT: D2.8(~{D}) ; port TAPE_BIT
TAPE_IN: C28.1 R16.2 X4.2 X8.1  [project net TAPE_IN_4]
TAPE_OUT: C31.2 R33.2 X8.3  [project net TAPE_OUT_4]
NetC28_2: C28.2 R15.1
NetC31_1: C31.1 C34.1 R34.2 R35.2
NetD2_4: D2.4(~{B}) R35.1
NetD2_9: D2.9(D) D2.10(~{E}) R14.1
NetD2_11: D2.11(E) D2.12(~{F}) R14.2 VD1.1(C) VD2.2(A)
NetD2_13: D2.13(F) R15.2 VD1.2(A) VD2.1(C)

Not connected (* = marked no-connect by the designer): X4 3 4

### Library data of the parts
C28 C31 = CMP-2007-03243-2: as C40 on sheet Power ATX; Manufacturer Part Number: C0805C106K8PACTU; Value: 10uF; Category: Cap; Case/Package: 0805
C34 C107 = CMP-2100-03606-3: as C50 on sheet Power ATX; Manufacturer Part Number: CC0805KRX7R9BB104; Category: Cap; Case/Package: 0805
D2 = CMP-1615-00195-3: as D2 on sheet AY Amp; Number of Pins: 14; Case/Package: SOIC; Manufacturer Part Number: CD4069UBM; value: CD4069UBM; Category: IC
R14 R16 R33 = CMP-02407-008731-1: as R112 on sheet Power ATX; Number of Terminations: 2; Termination: SMD/SMT; Case/Package: 0805; Manufacturer Part Number: CRCW080547K0FKEAHP; value: 47kΩ; Category: Res
R15 R34 = CMP-03412-000082-1: as R98 on sheet ESP32; Category: Res; Manufacturer Part Number: RT0805FRE07680RL; Resistance: 680Ω; Case/Package: 0805
R35 = CMP-07231-003724-1: Thick Film Chip Resistors 0805 2.2kΩ 0.125W 5% 200ppm/°C; Manufacturer: Bourns; Number of Terminations: 2; Termination: SMD/SMT; Case/Package: 0805; Manufacturer Part Number: CR0805-JW-222ELF; value: 2.2kΩ; Category: Res
VD1 VD2 = CMP-02540-000025-1: DIODE GEN PURP 75V 150MA SOD80; Manufacturer: Vishay; Capacitance: 4pF; Value: LS4148; Category: Diode; Manufacturer Part Number: LS4148-GS08; Case/Package: SOD80
X4 = SJ-3524-SMT-TR: Connector; Case/Package: Stereo jack smd; Category: Connector; Value: SJ-3524-SMT-TR
X8 = PLB2-2: Value: PLD-4; Case/Package: PLD-4; Category: Connector